# EasyEDA Pro project 2230506226.epro

# Schematic B1

## Sheets
1 ETH: Board Name: Project; Create Date: 2025-04-10; Page Name: ETH; Project Name: 14届真题; Schematic Name: B1; Update Date: 2025-04-10
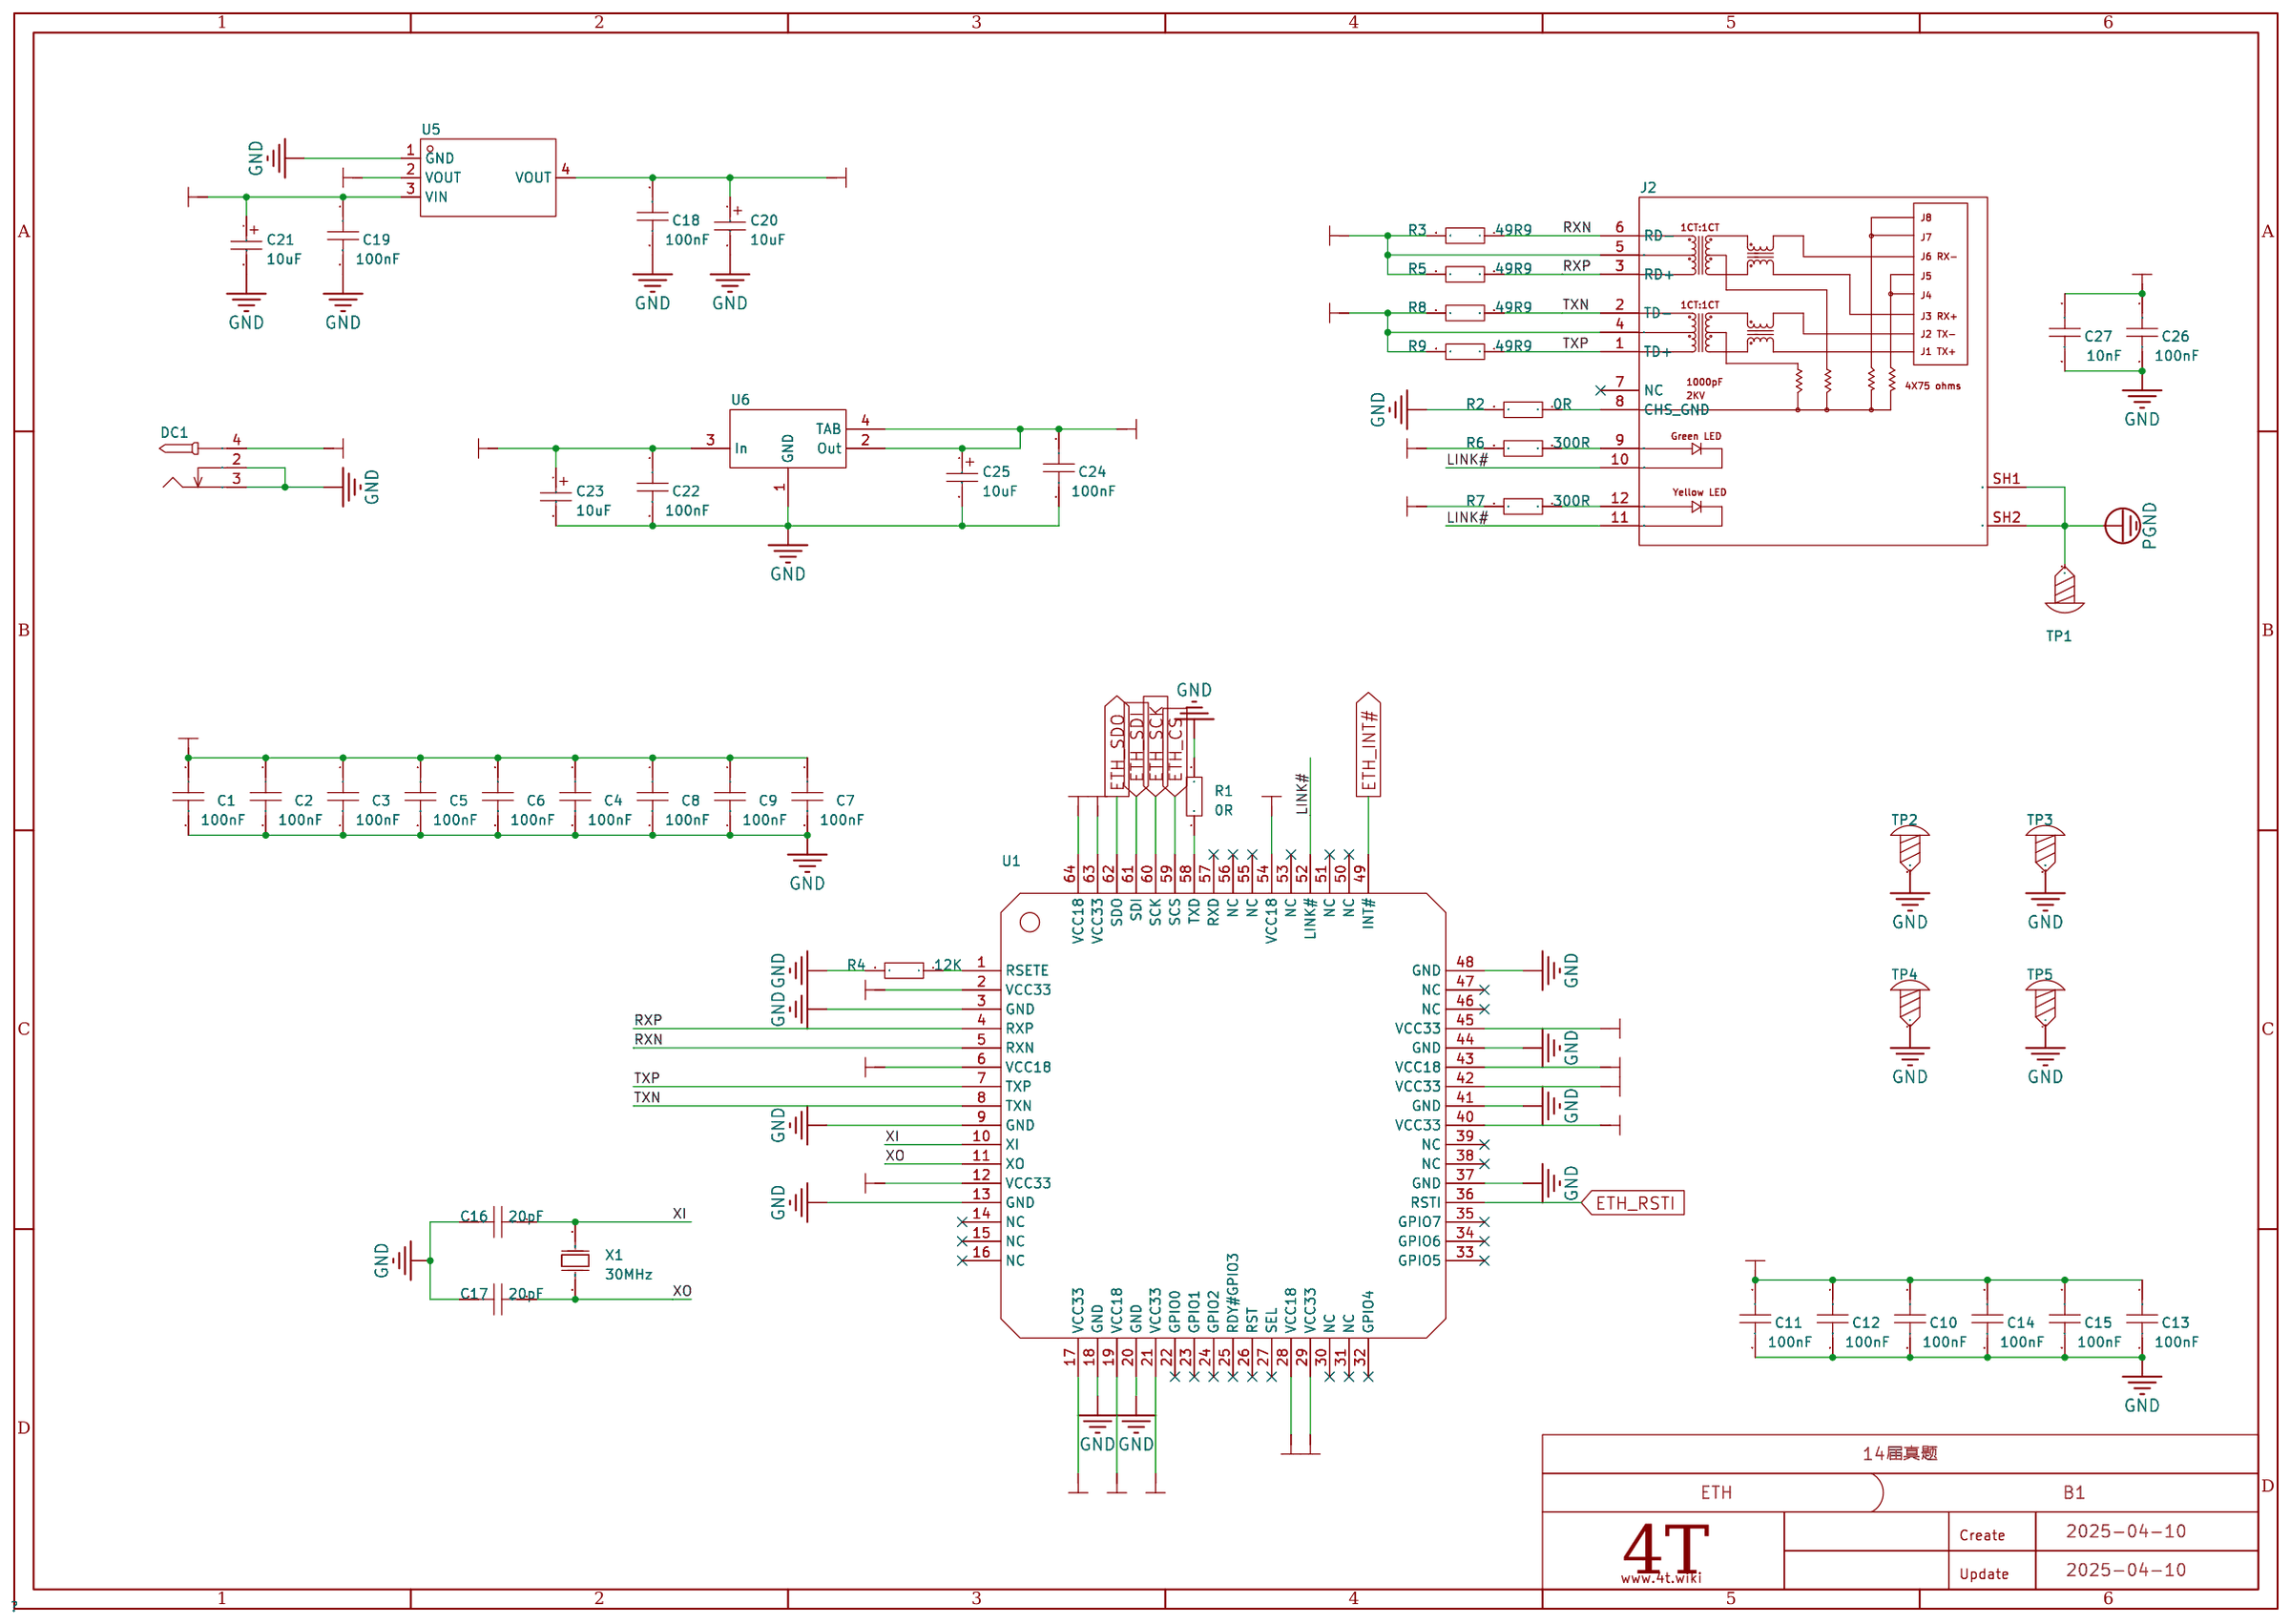
[diagram p0: ETH]
2 MP: Page Name: MP
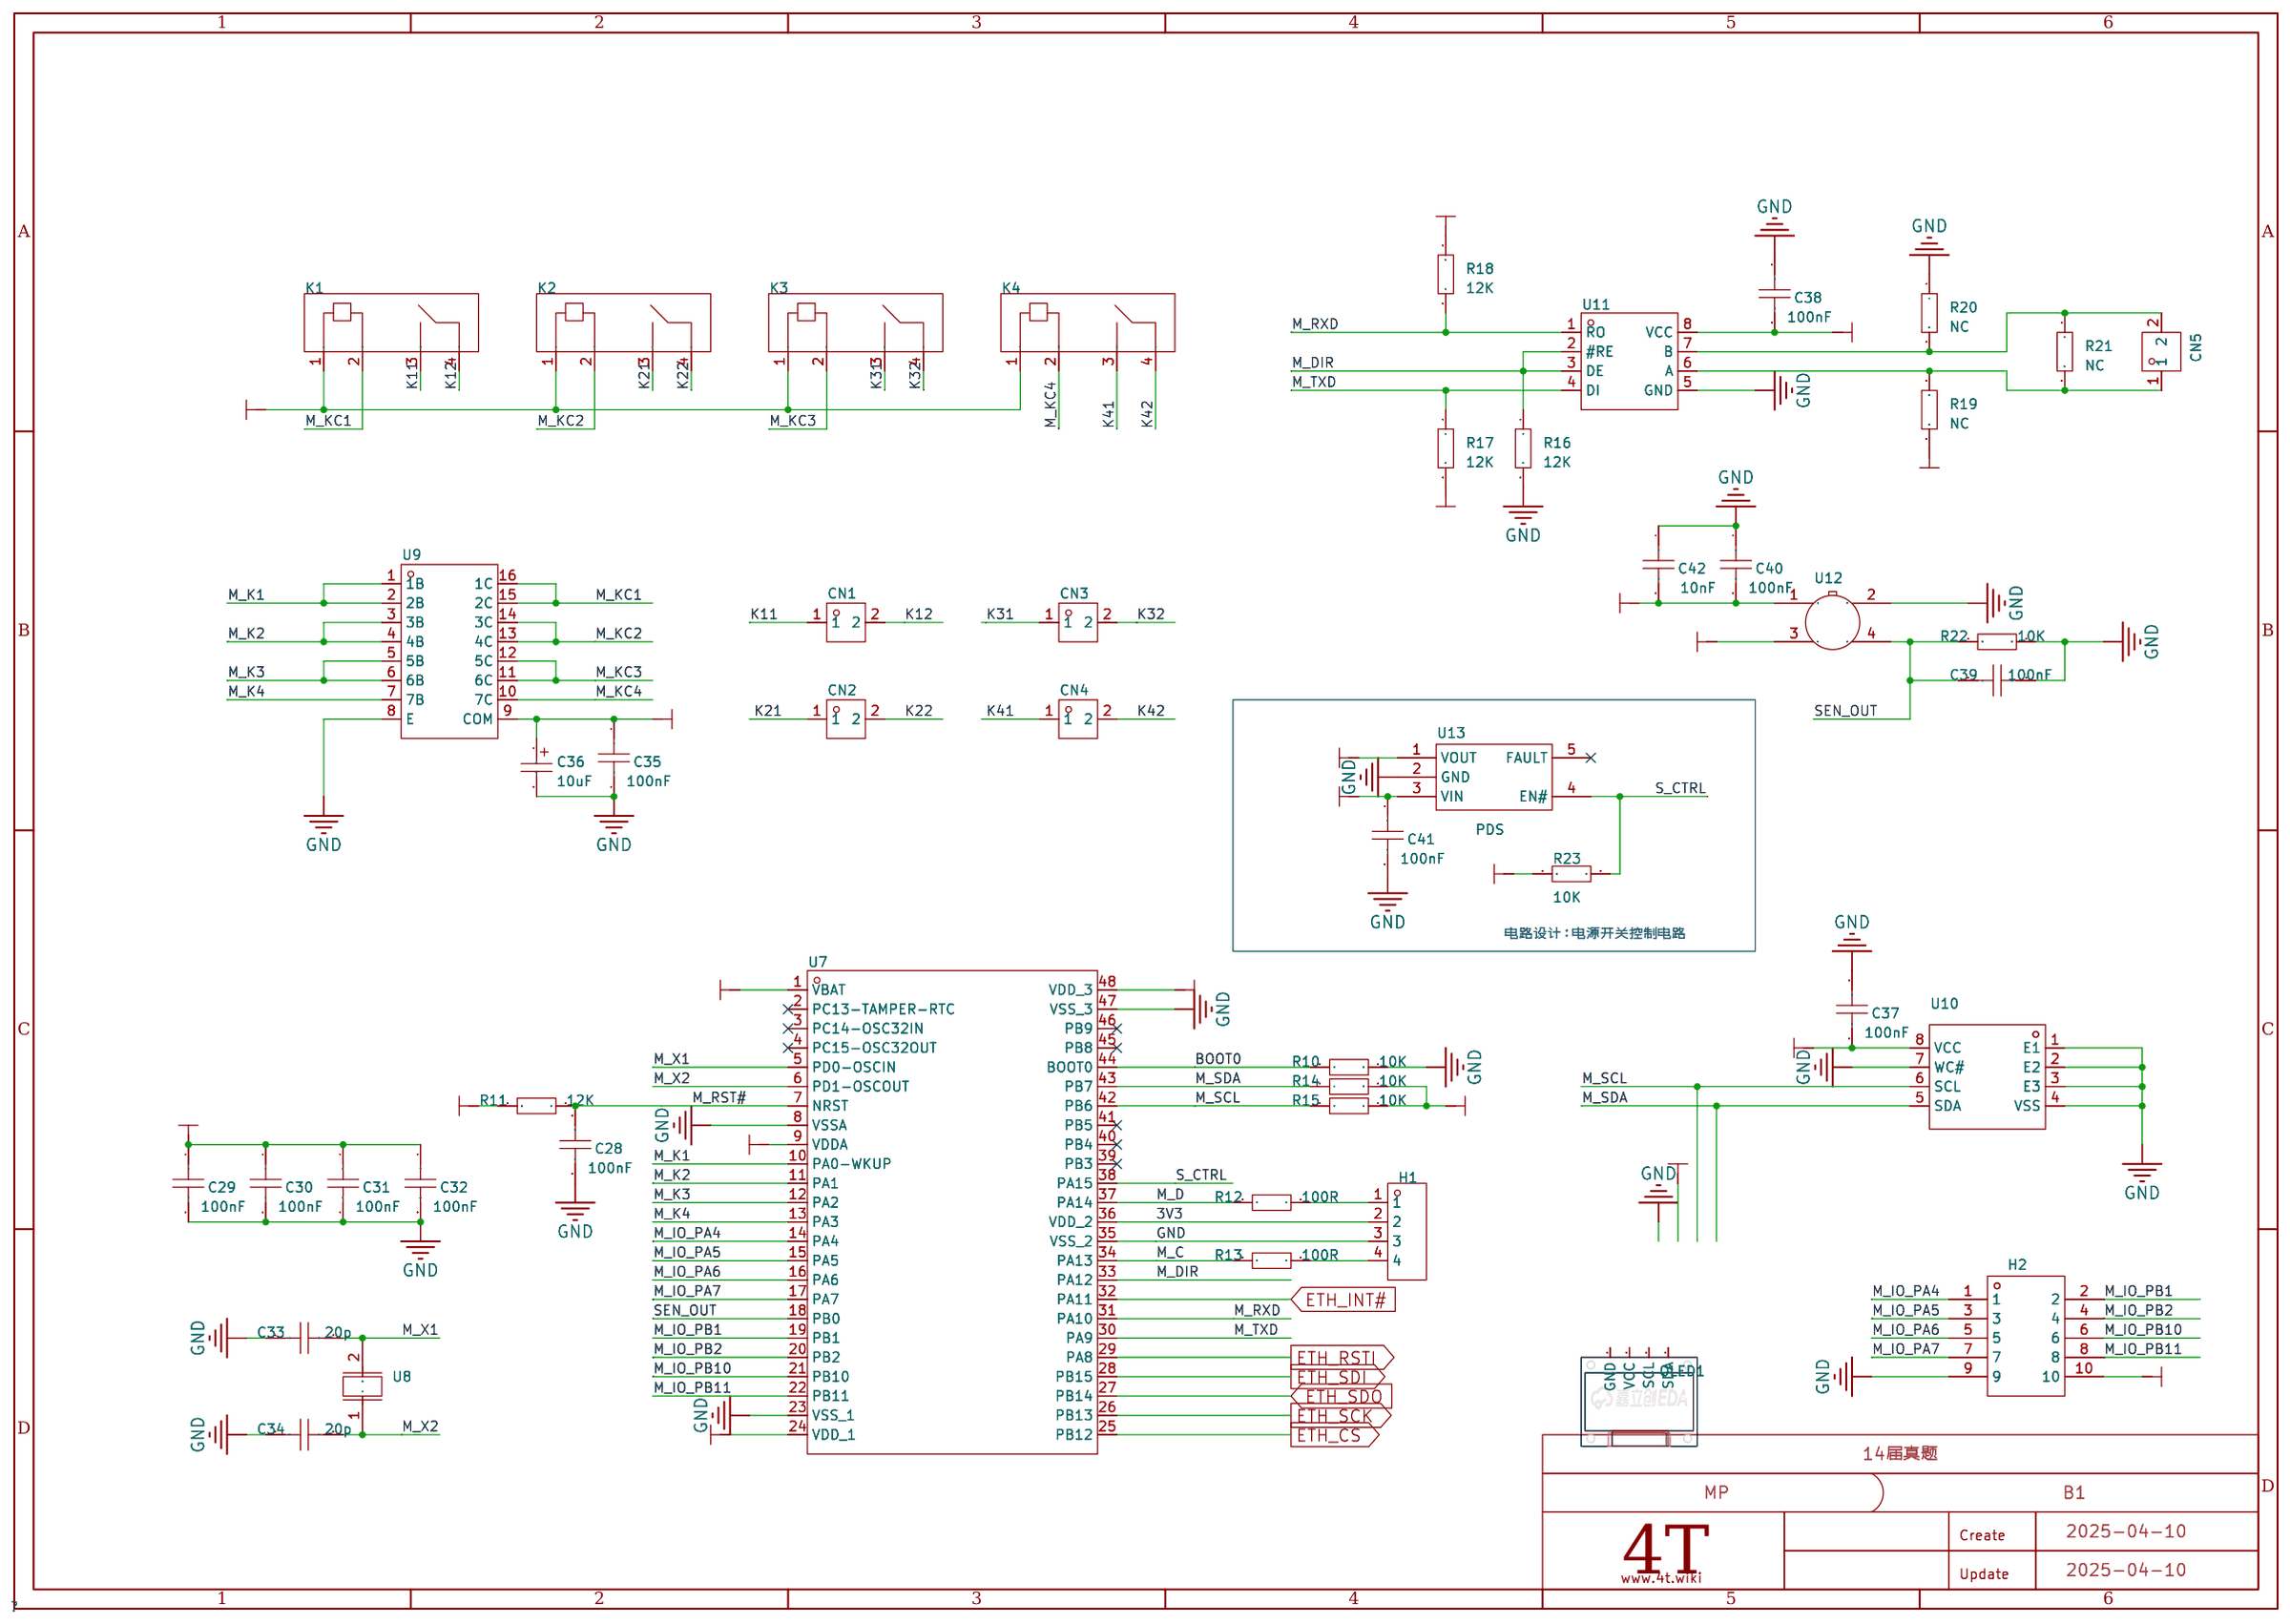
[diagram p1: MP]

## Parts
sheet ETH
C1  100nF  [C0805]
C2  100nF  [C0805]
C3  100nF  [C0805]
C4  100nF  [C0805]
C5  100nF  [C0805]
C6  100nF  [C0805]
C7  100nF  [C0805]
C8  100nF  [C0805]
C9  100nF  [C0805]
C10  100nF  [C0805]
C11  100nF  [C0805]
C12  100nF  [C0805]
C13  100nF  [C0805]
C14  100nF  [C0805]
C15  100nF  [C0805]
C16  20pF  [C0805]
C17  20pF  [C0805]
C18  100nF  [C0805]
C19  100nF  [C0805]
C20  10uF  [C_Ele_SMD_3x5.4mm]
C21  10uF  [C_Ele_SMD_3x5.4mm]
C22  100nF  [C0805]
C23  10uF  [C_Ele_SMD_3x5.4mm]
C24  100nF  [C0805]
C25  10uF  [C_Ele_SMD_3x5.4mm]
C26  100nF  [C0805]
C27  10nF  [C0805]
DC1  -  [DC-2.0]
J2  HY911105AE  [RJ45-TH_HR911105A]
R1  0R  [R0805]
R2  0R  [R0805]
R3  49R9  [R0805]
R4  12K  [R0805]
R5  49R9  [R0805]
R6  300R  [R0805]
R7  300R  [R0805]
R8  49R9  [R0805]
R9  49R9  [R0805]
TP1  -  [M3螺丝]
TP2  -  [M2螺丝]
TP3  -  [M2螺丝]
TP4  -  [M2螺丝]
TP5  -  [M2螺丝]
U1  CH395Q  [LQFP-64_L10.0-W10.0-P0.50-LS12.0-BL]
U5  AMS1117-3.3  [SOT-223-3_L6.5-W3.4-P2.30-LS7.0-BR]
U6  AMS1117-1.8  [SOT-223-4_L6.5-W3.5-P2.30-LS7.0-BR]
X1  30MHz  [OSC-SMD_L5.0-W3.2]
sheet MP
C28  100nF  [C0805]
C29  100nF  [C0805]
C30  100nF  [C0805]
C31  100nF  [C0805]
C32  100nF  [C0805]
C33  20p  [C0805]
C34  20p  [C0805]
C35  100nF  [C0805]
C36  10uF  [C_Ele_SMD_3x5.4mm]
C37  100nF  [C0805]
C38  100nF  [C0805]
C39  100nF  [C0805]
C40  100nF  [C0805]
C41  100nF  [C0805]
C42  10nF  [C0805]
CN1  KF128L-5.08-2P 蓝色  [TH_KF128L-5.08-2P]
CN2  KF128L-5.08-2P 蓝色  [TH_KF128L-5.08-2P]
CN3  KF128L-5.08-2P 蓝色  [TH_KF128L-5.08-2P]
CN4  KF128L-5.08-2P 蓝色  [TH_KF128L-5.08-2P]
CN5  KF128L-5.08-2P 蓝色  [TH_KF128L-5.08-2P]
H1  -  [HDR-TH_4P-P2.54-V-F]
H2  -  [HDR-TH_10P-P2.54-V-M-R2-C5-S2.54]
K1  HF49FD/012-1H12  [RELAY-TH_HF49FD-XXX-1H12-XXX]
K2  HF49FD/012-1H12  [RELAY-TH_HF49FD-XXX-1H12-XXX]
K3  HF49FD/012-1H12  [RELAY-TH_HF49FD-XXX-1H12-XXX]
K4  HF49FD/012-1H12  [RELAY-TH_HF49FD-XXX-1H12-XXX]
OLED1  -  [0.96OLED_4P]
R10  10K  [R0805]
R11  12K  [R0805]
R12  100R  [R0805]
R13  100R  [R0805]
R14  10K  [R0805]
R15  10K  [R0805]
R16  12K  [R0805]
R17  12K  [R0805]
R18  12K  [R0805]
R19  NC  [R0805]
R20  NC  [R0805]
R21  NC  [R0805]
R22  10K  [R0805]
R23  10K  [R0805]
U7  GD32F303CBT6  [LQFP-48_L7.0-W7.0-P0.50-LS9.0-BL]
U8  8M-5032-2P  [CRYSTAL-SMD_L5.0-W3.2]
U9  ULN2003  [SOIC-16_L9.9-W3.9-P1.27-LS6.0-BL]
U10  M24C02-WMN6TP  [SOIC-8_L4.9-W3.9-P1.27-LS6.0-BL]
U11  MAX3485ESA  [SOP-8_L5.0-W4.0-P1.27-LS6.0-BL]
U12  MP-2  [SENSOR-TH_MP-5]
U13  PDS  [SOT_PDS]

## Library data of the parts
C1-C19 C22 C24 C26-C35 C37-C42 = CAP_0603: Supplier Footprint: 0603
C20 C21 C23 C25 C36 = C_Ele_SMD_3x5.4mm: Supplier Footprint: SMD,3x5.4mm
DC1 = DC-005_2.0: Supplier Footprint: 插件
J2 = HY911105AE: 连接器类型:RJ插座;USOC代码:RJ45;端口数量:1;等级:-;屏蔽:-;LED:-;; LCSC Part Name: RJ45 带变压器; Supplier Part: C69427; Manufacturer: HANRUN(汉仁); Supplier Footprint: 插件; JLCPCB Part Class: 扩展库; Datasheet: https://atta.szlcsc.com/upload/public/pdf/source/20160507/1462613611469.pdf; Supplier: LCSC; Connector Type: RJ插座; USOC Codes: RJ45; Number of Ports: 1
R1-R23 = Res_0805: Supplier Footprint: 0805
TP1 = M3螺丝: Supplier Footprint: 插件
TP2-TP5 = M2螺丝: Supplier Footprint: 插件
U1 = CH395Q: 应用功能:以太网控制器;通道数:-;接口类型:Parallel, SPI, UART;电源电压:1.65V~3.6V;电源电流:90mA;; Supplier Part: C87390; Manufacturer: WCH(南京沁恒); Supplier Footprint: LQFP-64(10x10); JLCPCB Part Class: 扩展库; Datasheet: https://atta.szlcsc.com/upload/public/pdf/source/20200903/C87390_2BA27438C515B4B897A780BE99160E01.pdf; Supplier: LCSC; Application Function: 以太网控制器; Interface: Parallel, SPI, UART; Supply Voltage: 1.65V~3.6V; Supply Current: 90mA
U5 = AMS1117-3.3_C6186: 输出类型:固定;输出极性:正;输出通道数:1;最大输入电压:-;输出电压:3.3V;压差:1.3V@(800mA);静态电流(地电流):-;输出电流:1A;电源纹波抑制比(PSRR):72dB@(120Hz);噪声:-;特性:-;工作温度:-;; LCSC Part Name: 正 Vout=3.3V 1A 72dB@(120Hz); Supplier Part: C6186; Manufacturer: AMS; Supplier Footprint: SOT-223-3; JLCPCB Part Class: 基础库; Datasheet: https://atta.szlcsc.com/upload/public/pdf/source/20180727/C6186_7A095716F0823C02F1997A905E26C086.pdf; Supplier: LCSC; Output Type: 固定; Output Polarity: 正; Number of Outputs: 1; Output Voltage: 3.3V; Dropout Voltage: 1.3V@(800mA); Output Current: 1A; Power Supply Rejection Ratio (PSRR): 72dB@(120Hz)
U6 = AMS1117-1.8_C6185: 输出类型:固定;输出极性:正;输出通道数:1;最大输入电压:15V;输出电压:1.8V~1.8V;压差:1.3V@(1A);输出电流:1A;电源纹波抑制比(PSRR):75dB@(120Hz);; LCSC Part Name: 正 Vin=15V Vout=1.8V~1.8V 1A 75dB@(120Hz); Supplier Part: C6185; Manufacturer: AMS; Supplier Footprint: SOT-223-4; JLCPCB Part Class: 扩展库; Datasheet: https://atta.szlcsc.com/upload/public/pdf/source/20180727/C6186_7A095716F0823C02F1997A905E26C086.pdf; Supplier: LCSC; Output Type: 固定; Output Polarity: 正; Number of Outputs: 1; Maximum Input Voltage: 15V; Output Voltage: 1.8V~1.8V; Dropout Voltage: 1.3V@(1A); Output Current: 1A; Power Supply Rejection Ratio (PSRR): 75dB@(120Hz)
X1 = X503230MSB2GI: 晶振类型:贴片无源晶振;频率:30MHz;频率公差:±10ppm;频率稳定度:±50ppm;负载电容:20pF;工作温度:-40℃~+85℃;; LCSC Part Name: YSX530GA 30MHz ±10ppm 20pF; Supplier Part: C112563; Manufacturer: YXC(扬兴晶振); Supplier Footprint: SMD5032-2P; JLCPCB Part Class: 扩展库; Datasheet: https://atta.szlcsc.com/upload/public/pdf/source/20210329/C112559_847D3CACBA33ACCEB57DEA3AEBB187A1.pdf; Supplier: LCSC; Crystal Type: 贴片无源晶振; Frequency Tolerance: ±10ppm; Frequency Stability: ±50ppm; Load Capacitance: 20pF; Operating Temperature: -40℃~+85℃
CN1-CN5 = KF128L-5.08-2P 蓝色: Supplier Part: C2916931; Supplier Footprint: 5.08-2P; JLCPCB Part Class: 扩展库; Supplier: LCSC
H1 = HDR-F_2.54_1x4P: Supplier Part: C2718488; Supplier Footprint: 插件
H2 = HDR-M_2.54_2x5: Supplier Part: C124387; Supplier Footprint: 插件,P=2.54mm
K1-K4 = HF49FD/012-1H12: 线圈电压:12V;线圈类型:非极化-单线圈;触点形式:一组常开:1A(单刀单掷-常开);最大切换电流:5A;触点材料:AgNi;; LCSC Part Name: 宏发继电器; Supplier Part: C399491; Manufacturer: HF(宏发); Supplier Footprint: SIP-4; JLCPCB Part Class: 扩展库; Datasheet: https://atta.szlcsc.com/upload/public/pdf/source/20190620/C399491_B2190B02DDD565265172868420E7880D.pdf; Supplier: LCSC; Coil Voltage: 12V; Coil Type: 非极化-单线圈; Pin Number: 4; Contact Form: 一组常开:1A(单刀单掷-常开); Maximum Switching Current: 5A; Maximum Switching Voltage: 250V@AC；30V@DC; Coil Rated Power: 120mW; Contact Rating: 5A@30VDC；5A@250VAC; Coil Resistance: 1.2kΩ; Operate Time: 10ms; Release Time: 5ms; Contact Resistance: 100mΩ; Contact Material: AgNi; Operating Temperature: -40℃~+85℃
OLED1 = 0.96OLED模块_4P: Supplier Footprint: 插件
U7 = GD32F303CBT6_C3013779: CPU内核:ARM Cortex-M4;CPU最大主频:120MHz;工作电压范围:-;程序存储容量:128KB;RAM总容量:32KB;EEPROM/数据 FLASH容量:128KB;GPIO端口数量:37;ADC(位数):12bit;DAC(位数):12bit;(E)PWM(位数):-;8位Timer数量:-;16位Timer数量:7;32位Timer数量:-;CAN路数:1;U(S)ART路数:3;I2C路数:2;I2S路数:2;(Q)SPI路数:3;外设/功能:看门狗；RTC实时时钟;内部振荡器:; LCSC Part Name: ARM Cortex-M4 120MHz; Supplier Part: C3013779; Manufacturer: GigaDevice(兆易创新); Supplier Footprint: LQFP-48(7x7); JLCPCB Part Class: 扩展库; Datasheet: https://atta.szlcsc.com/upload/public/pdf/source/20220624/E1A57ED816B162D6D1424864911A792F.pdf; Supplier: LCSC; CPU Core: ARM Cortex-M4; CPU Maximum Speed: 120MHz; Program Storage Size: 128KB; Program Memory Type: FLASH; RAM Size: 32KB; EEPROM: 128KB; GPIO Ports Number: 37; ADC (Bit): 12bit; DAC (Bit): 12bit; 16Bit Timer: 7; CAN: 1; UART/USART: 3; I2C: 2; I2S: 2; SPI: 3; Peripheral/Function: 看门狗；RTC实时时钟; Watchdog: 有; Real-Time Clock: 有
U8 = 8M-5032-2P: Supplier Part: C9900017580; Supplier Footprint: 8MHz; JLCPCB Part Class: 扩展库; Supplier: LCSC
U9 = ULN2003: 开态输入电压(VI(on)@Vce,Ic):3V@2V,300mA;集射极饱和压降(VCE(sat)@Ii,Ic):1.2V@500uA,350mA;输出漏电流(Icex@Vce):50uA@50V;开态输入电流(Ii@Vi):-;关态输入电流(Ii(off)@Vce,Ic):65uA@50V,500uA;嵌位二极管漏电流(IR@VR):50uA@50V;嵌位二极管正向压降(VF@IF):1.7V@350mA;输入电容(Ci):15pF;工作温度:-20℃~+85℃;; Supplier Part: C688859; Manufacturer: IDCHIP(英锐芯); Supplier Footprint: SOIC-16; JLCPCB Part Class: 扩展库; Datasheet: https://atta.szlcsc.com/upload/public/pdf/source/20210302/C688859_5C67C6CBB0EA78EF92AFC966B53E1AD0.pdf; Supplier: LCSC; ON-state input   voltage(VI(on)@Vce,Ic): 3V@2V,300mA; Collector-emitter   saturation voltage (VCE(sat)@Ii,Ic): 1.2V@500uA,350mA; Output leakage current (Icex@Vce): 50uA@50V; Off-state input current (Ii(off)@Vce,Ic): 65uA@50V,500uA; Clamp Diode Leakage Current (IR@VR): 50uA@50V; Clamp Diode Forward Voltage (VF@IF): 1.7V@350mA; Input Capacitance (Ci): 15pF; Operating Temperature: -20℃~+85℃
U10 = M24C02-WMN6TP: 2-Kbit(256 x 8bit)，I2C接口，工作电压：2.5V to 5.5V; Supplier Part: C7562; Manufacturer: ST(意法半导体); Supplier Footprint: SOIC-8; JLCPCB Part Class: 基础库; Datasheet: https://atta.szlcsc.com/upload/public/pdf/source/20140724/1457707167301.pdf; Supplier: LCSC
U11 = MAX3485ESA: Supplier Part: C668204; Manufacturer: UMW(广东友台半导体); Supplier Footprint: SOP-8; JLCPCB Part Class: 扩展库; Datasheet: https://atta.szlcsc.com/upload/public/pdf/source/20221009/BC018EFD0F414E24649E284F574E449C.pdf; Supplier: LCSC
U12 = MP-2: Supplier Part: C242497; Manufacturer: Winsen(炜盛); Supplier Footprint: 插件; JLCPCB Part Class: 扩展库; Datasheet: https://atta.szlcsc.com/upload/public/pdf/source/20180704/C242497_B8D2418C2743DA3210851F2FB82DA8BD.pdf; Supplier: LCSC
U13 = PDS

## Nets
1V8: C10.1 C11.1 C12.1 C13.1 C14.1 C15.1 C24.1 C25.1 U1.6(VCC18) U1.19(VCC18) U1.28(VCC18) U1.43(VCC18) U1.54(VCC18) U1.63(VCC33) U6.2(Out) U6.4(TAB)
3V3: C1.1 C2.1 C3.1 C4.1 C5.1 C6.1 C7.1 C8.1 C9.1 C18.1 C20.1 C22.1 C23.1 C26.1 C27.1 C29.1 C30.1 C31.1 C32.1 C37.2 C38.2 H1.2 H2.10 J2.4 J2.5 R3.2 R5.2 R6.2 R7.2 R8.2 R9.2 R11.2 R14.2 R15.1 R17.2 R18.1 R19.2 R23.1 U1.2(VCC33) U1.12(VCC33) U1.17(VCC33) U1.21(VCC33) U1.29(VCC33) U1.40(VCC33) U1.42(VCC33) U1.45(VCC33) U1.64(VCC18) U5.2(VOUT) U5.4(VOUT) U6.3(In) U7.1(VBAT) U7.9(VDDA) U7.24(VDD_1) U7.36(VDD_2) U7.48(VDD_3) U10.8(VCC) U11.8(VCC) U12.3
GND: C1.2 C2.2 C3.2 C4.2 C5.2 C6.2 C7.2 C8.2 C9.2 C10.2 C11.2 C12.2 C13.2 C14.2 C15.2 C16.1 C17.1 C18.2 C19.2 C20.2 C21.2 C22.2 C23.2 C24.2 C25.2 C26.2 C27.2 C28.2 C29.2 C30.2 C31.2 C32.2 C33.1 C34.1 C35.2 C36.2 C37.1 C38.1 C39.2 C40.1 C41.2 C42.1 DC1.2 DC1.3 H1.3 H2.9 R1.2 R2.2 R4.2 R10.1 R16.2 R20.1 R22.2 TP2.1 TP3.1 TP4.1 TP5.1 U1.3(GND) U1.9(GND) U1.13(GND) U1.18(GND) U1.20(GND) U1.37(GND) U1.41(GND) U1.44(GND) U1.48(GND) U5.1(GND) U6.1(GND) U7.8(VSSA) U7.23(VSS_1) U7.35(VSS_2) U7.47(VSS_3) U9.8(E) U10.1(E1) U10.2(E2) U10.3(E3) U10.4(VSS) U10.7(WC#) U11.5(GND) U12.2 U13.2(GND)
PGND: J2.SH1 J2.SH2 TP1.1
BOOT0: R10.2 U7.44(BOOT0)
DC: C19.1 C21.1 C35.1 C36.1 C41.1 DC1.4 K1.1 K2.1 K3.1 K4.1 U5.3(VIN) U9.9(COM) U13.3(VIN)
ETH_CS: U1.59(SCS) U7.25(PB12)
ETH_INT#: U1.49(INT#) U7.32(PA11)
ETH_RSTI: U1.36(RSTI) U7.29(PA8)
ETH_SCK: U1.60(SCK) U7.26(PB13)
ETH_SDI: U1.61(SDI) U7.28(PB15)
ETH_SDO: U1.62(SDO) U7.27(PB14)
K11: CN1.1 K1.3
K12: CN1.2 K1.4
K21: CN2.1 K2.3
K22: CN2.2 K2.4
K31: CN3.1 K3.3
K32: CN3.2 K3.4
K41: CN4.1 K4.3
K42: CN4.2 K4.4
LINK#: J2.10 J2.11 U1.52(LINK#)
M_C: R13.2 U7.34(PA13)
M_D: R12.2 U7.37(PA14)
M_DIR: R16.1 U7.33(PA12) U11.2(#RE) U11.3(DE)
M_IO_PA4: H2.1 U7.14(PA4)
M_IO_PA5: H2.3 U7.15(PA5)
M_IO_PA6: H2.5 U7.16(PA6)
M_IO_PA7: H2.7 U7.17(PA7)
M_IO_PB1: H2.2 U7.19(PB1)
M_IO_PB2: H2.4 U7.20(PB2)
M_IO_PB10: H2.6 U7.21(PB10)
M_IO_PB11: H2.8 U7.22(PB11)
M_K1: U7.10(PA0-WKUP) U9.1(1B) U9.2(2B)
M_K2: U7.11(PA1) U9.3(3B) U9.4(4B)
M_K3: U7.12(PA2) U9.5(5B) U9.6(6B)
M_K4: U7.13(PA3) U9.7(7B)
M_KC1: K1.2 U9.15(2C) U9.16(1C)
M_KC2: K2.2 U9.13(4C) U9.14(3C)
M_KC3: K3.2 U9.11(6C) U9.12(5C)
M_KC4: K4.2 U9.10(7C)
M_RST#: C28.1 R11.1 U7.7(NRST)
M_RXD: R18.2 U7.31(PA10) U11.1(RO)
M_SCL: R15.2 U7.42(PB6) U10.6(SCL)
M_SDA: R14.1 U7.43(PB7) U10.5(SDA)
M_TXD: R17.1 U7.30(PA9) U11.4(DI)
M_X1: C33.2 U7.5(PD0-OSCIN) U8.2
M_X2: C34.2 U7.6(PD1-OSCOUT) U8.1
RXN: J2.6(RD-) R3.1 U1.5(RXN)
RXP: J2.3(RD+) R5.1 U1.4(RXP)
S_CTRL: R23.2 U7.38(PA15) U13.4(EN#)
SEN_OUT: C39.1 R22.1 U7.18(PB0) U12.4
TXN: J2.2(TD-) R8.1 U1.8(TXN)
TXP: J2.1(TD+) R9.1 U1.7(TXP)
V_HU: C40.2 C42.2 U12.1 U13.1(VOUT)
XI: C16.2 U1.10(XI) X1.2(OSC2)
XO: C17.2 U1.11(XO) X1.1(OSC1)
$1N6890: R4.1 U1.1(RSETE)
$1N7627: R1.1 U1.58(TXD)
$1N10654: J2.8(CHS GND) R2.1
$1N10919: J2.12 R7.1
$1N10952: J2.9 R6.1
$2N5291: H1.1 R12.1
$2N5344: H1.4 R13.1
$2N14954: CN5.2 R20.2 R21.1 U11.7(B)
$2N14989: CN5.1 R19.1 R21.2 U11.6(A)

Not connected (* = marked no-connect by the designer): J2 7(NC)*; OLED1 1(GND) 2(VCC) 3(SCL) 4(SDA); U1 14(NC)* 15(NC)* 16(NC)* 22(GPIO0)* 23(GPIO1)* 24(GPIO2)* 25(RDY#GPIO3)* 26(RST)* 27(SEL)* 30(NC)* 31(NC)* 32(GPIO4)* 33(GPIO5)* 34(GPIO6)* 35(GPIO7)* 38(NC)* 39(NC)* 46(NC)* 47(NC)* 50(NC)* 51(NC)* 53(NC)* 55(NC)* 56(NC)* 57(RXD)*; U7 2(PC13-TAMPER-RTC)* 3(PC14-OSC32IN)* 4(PC15-OSC32OUT)* 39(PB3)* 40(PB4)* 41(PB5)* 45(PB8)* 46(PB9)*; U13 5(FAULT)*

## Notes on the sheets
sheet 2
- 电路设计：电源开关控制电路

# Board B1
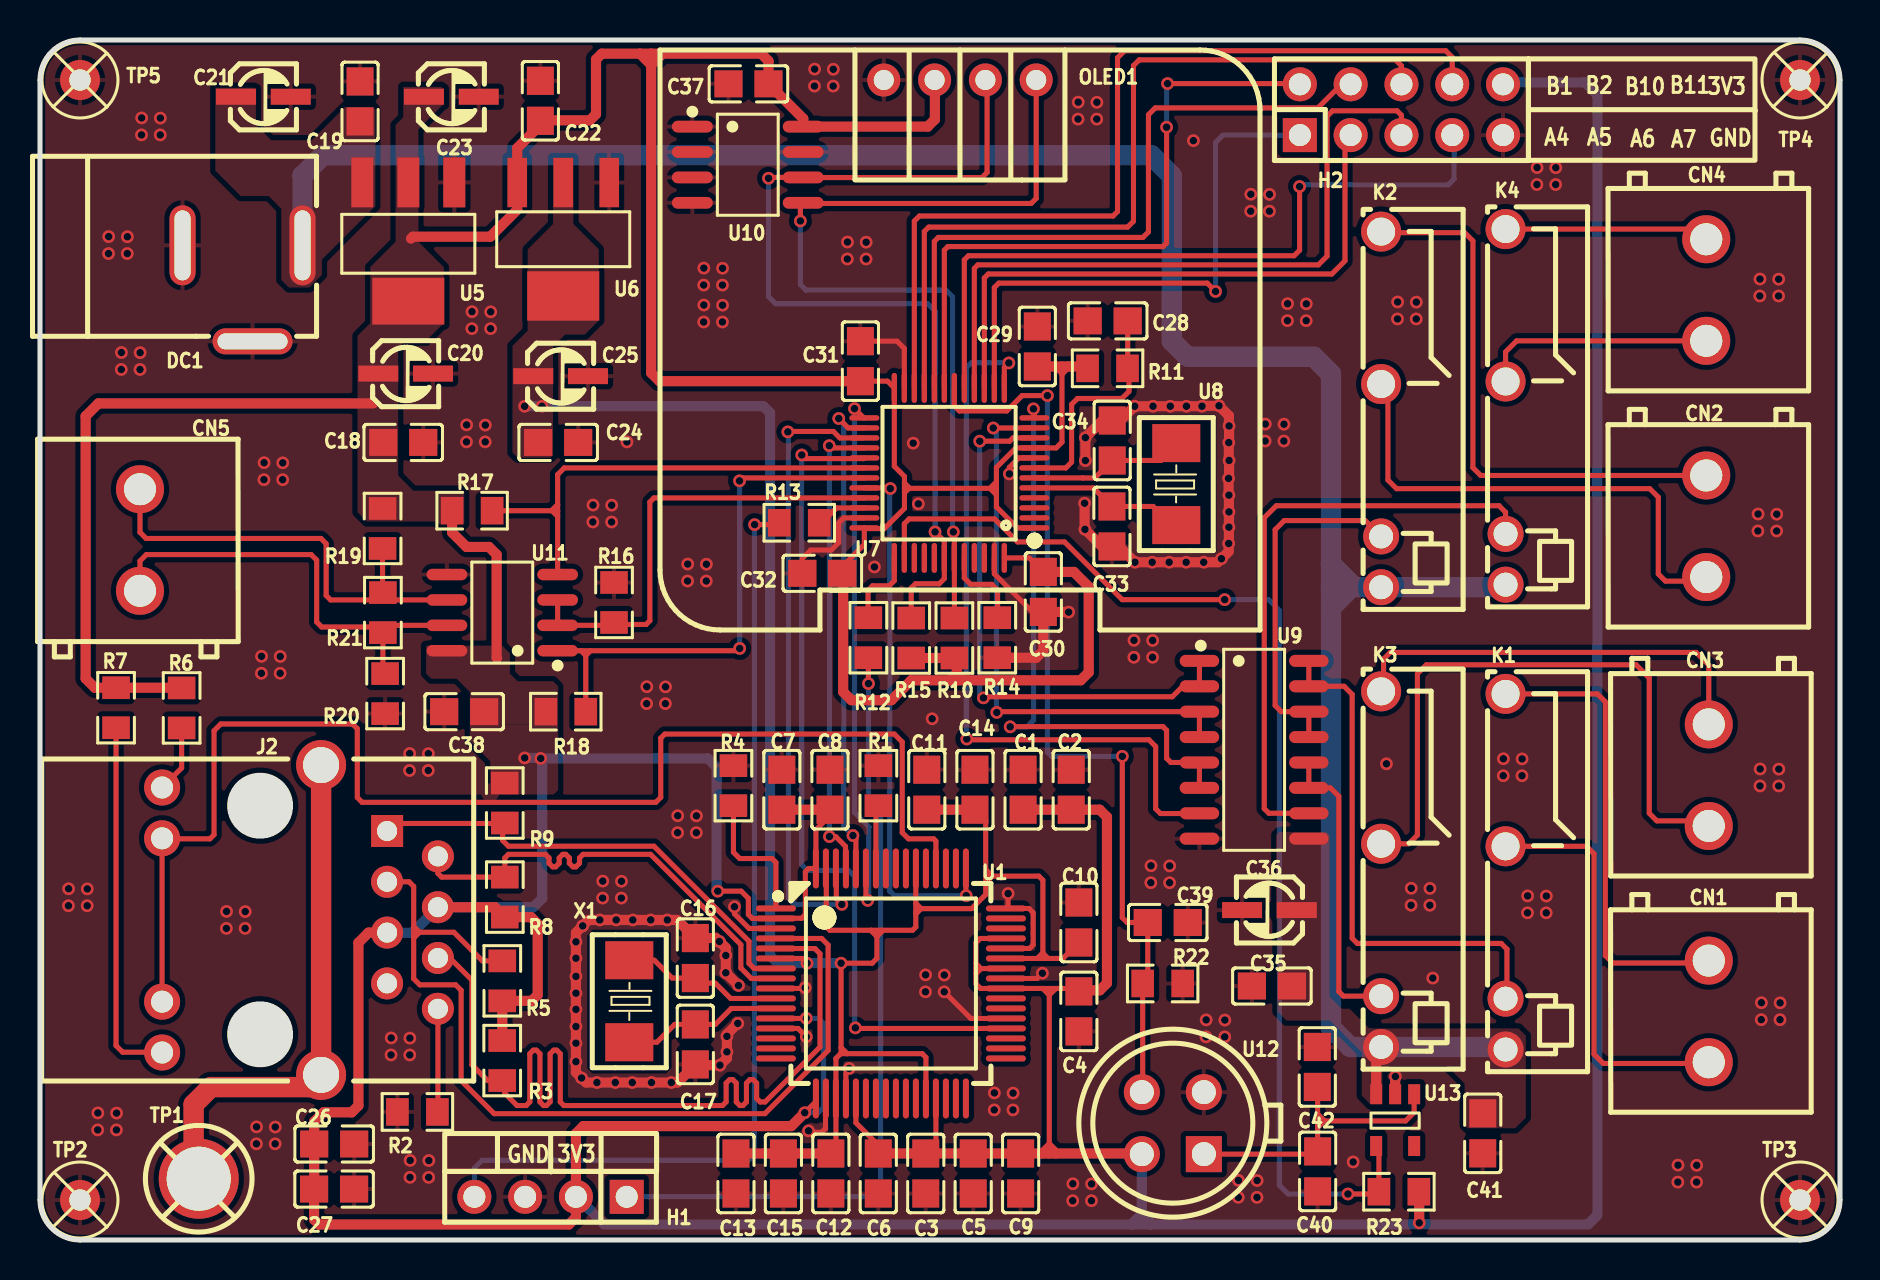
[diagram p2: board, top side]
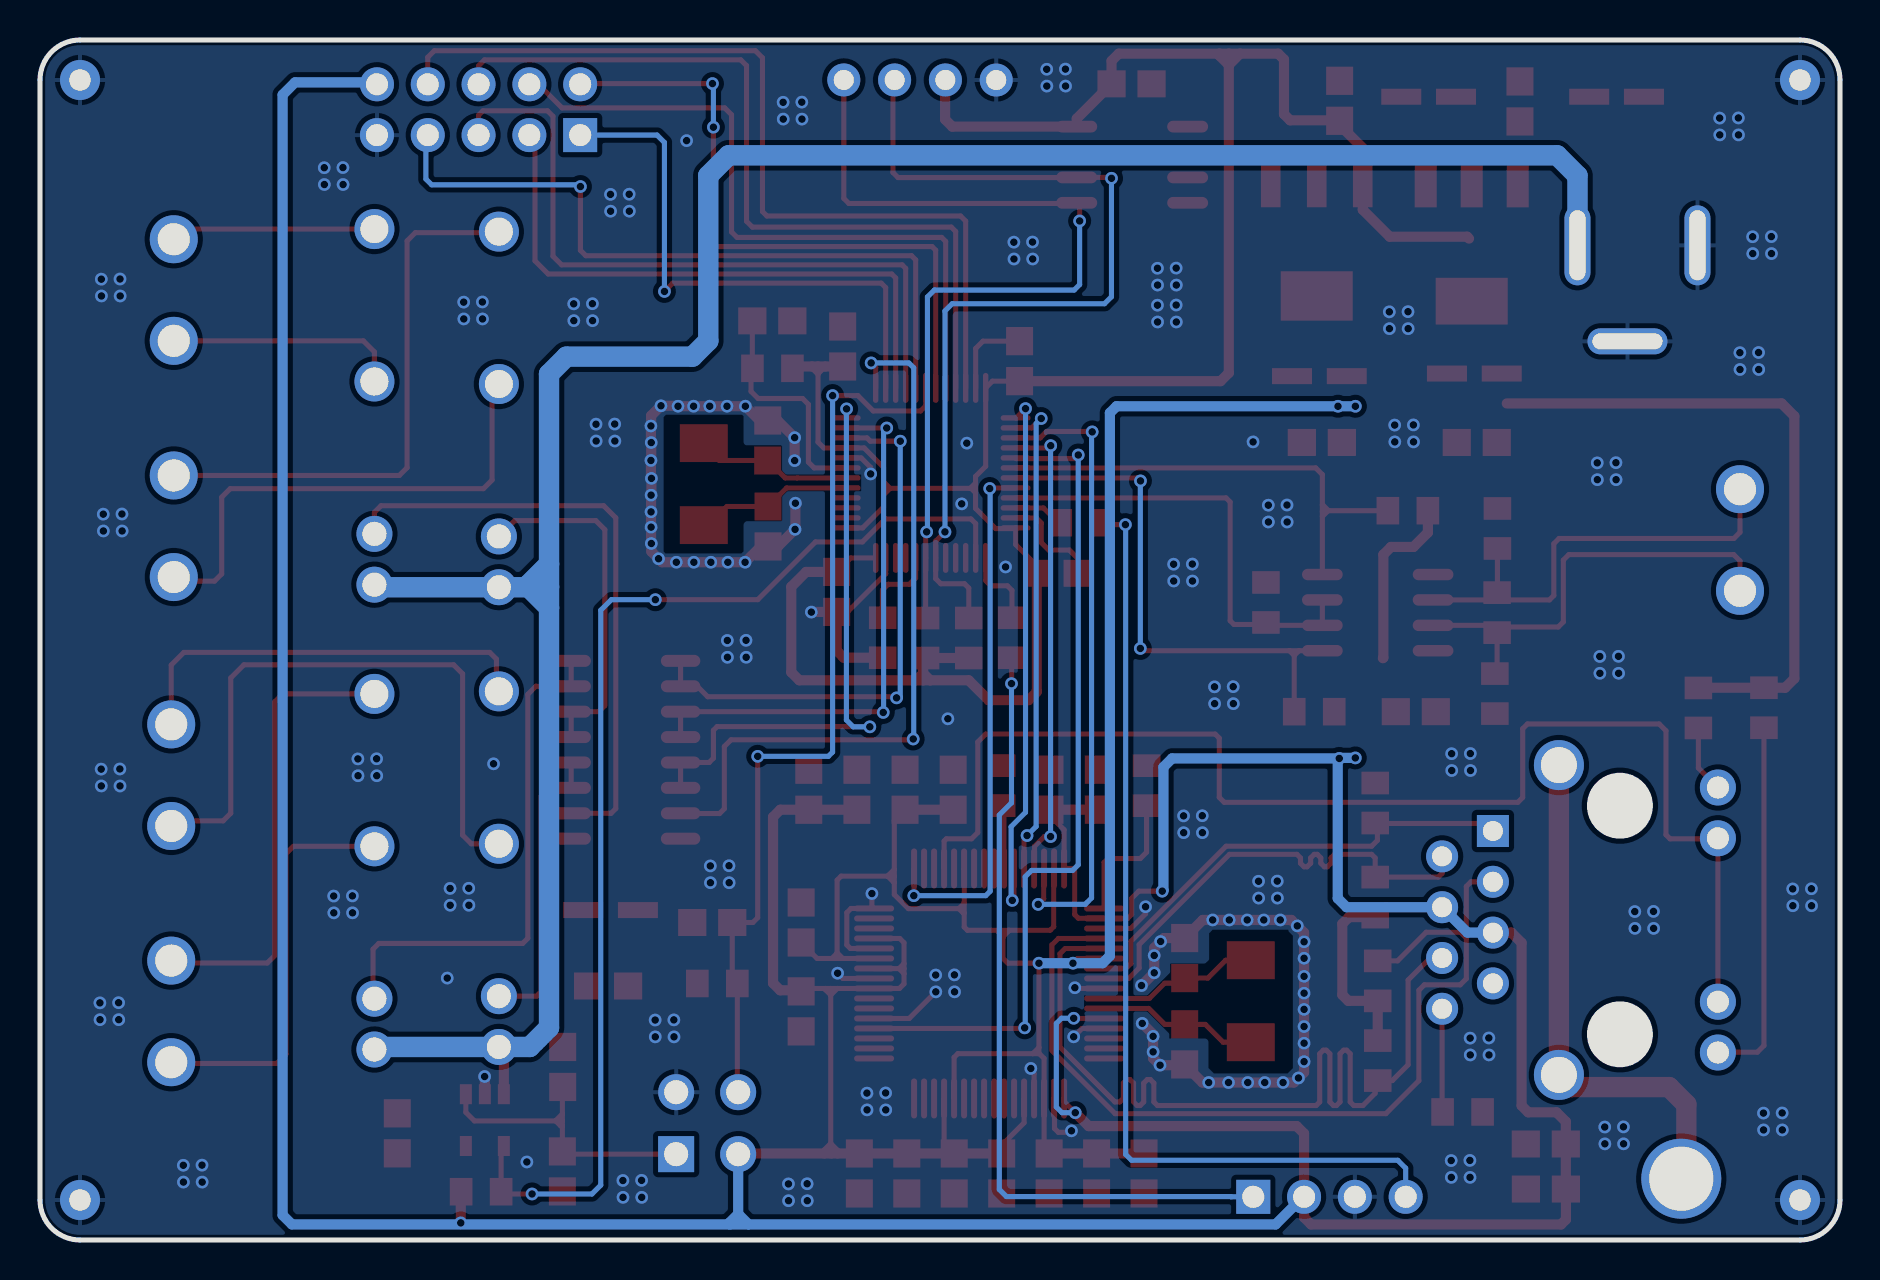
[diagram p3: board, bottom side, seen from below]

Outline 90 x 60 mm; copper layers: Top Layer, Bottom Layer. Coordinates in mm from the lower left corner of the outline.
Outline path: 0,58 0,2 arc(0.59,0.59) 2,0 88,0 arc(89.41,0.59) 90,2 90,58 arc(89.41,59.41) 88,60 2,60 arc(0.59,59.41) 0,58
Stack: Top Layer 0.035mm / Dielectric1 1.51mm FR4 er 4.5 / Bottom Layer 0.035mm

## Design rules (mm)
net $2N14989: AB
net $2N14954: AB
net TXP: TX_NP
net TXN: TX_NP
net RXP: RX_NP
net RXN: RX_NP
template: 用户自定义配置
spacing safeClearance (default): track to track 0.203, other pairs 0.152 to 0.203
track width trackWidth (default): min 0.254, default 0.254, max 2.54
track width pwr: min 0.254, default 0.508, max 2.54
differential pair differentialPair (default): width min 0.127, default 0.254, max 2.54; gap min 0.152, default 0.152
via viaSize (default): diameter min 0.635, default 0.635, max 10; hole min 0.381, default 0.381, max 5.999
net 3V3 uses pwr
net GND uses pwr
net PGND uses pwr
net 1V8 uses pwr
net DC uses pwr

## Placement (name value [footprint] x y rotation side)
C1  100nF  [C0805]  49.16 22.51 90 top
C2  100nF  [C0805]  51.56 22.51 90 top
C3  100nF  [C0805]  44.29 3.33 270 top
C4  100nF  [C0805]  51.94 11.43 270 top
C5  100nF  [C0805]  46.66 3.33 270 top
C6  100nF  [C0805]  41.91 3.33 270 top
C7  100nF  [C0805]  37.09 22.51 90 top
C8  100nF  [C0805]  39.5 22.51 90 top
C9  100nF  [C0805]  49.03 3.33 270 top
C10  100nF  [C0805]  51.94 15.88 90 top
C11  100nF  [C0805]  44.34 22.51 90 top
C12  100nF  [C0805]  39.54 3.33 270 top
C13  100nF  [C0805]  34.8 3.33 270 top
C14  100nF  [C0805]  46.75 22.51 90 top
C15  100nF  [C0805]  37.17 3.33 270 top
C16  20pF  [C0805]  32.77 14.1 270 top
C17  20pF  [C0805]  32.77 9.78 90 top
C18  100nF  [C0805]  18.16 39.88 0 top
C19  100nF  [C0805]  16 56.93 90 top
C20  10uF  [C_Ele_SMD_3x5.4mm]  18.29 43.31 180 top
C21  10uF  [C_Ele_SMD_3x5.4mm]  11.18 57.15 180 top
C22  100nF  [C0805]  25.02 56.96 90 top
C23  10uF  [C_Ele_SMD_3x5.4mm]  20.57 57.15 180 top
C24  100nF  [C0805]  25.91 39.88 0 top
C25  10uF  [C_Ele_SMD_3x5.4mm]  26.03 43.18 180 top
C26  100nF  [C0805]  14.71 4.8 0 top
C27  10nF  [C0805]  14.7 2.55 0 top
C28  100nF  [C0805]  53.38 45.96 180 top
C29  100nF  [C0805]  49.87 44.68 90 top
C30  100nF  [C0805]  50.17 32.4 270 top
C31  100nF  [C0805]  41.02 43.94 90 top
C32  100nF  [C0805]  39.12 33.33 180 top
C33  20p  [C0805]  53.6 35.68 90 top
C34  20p  [C0805]  53.61 39.98 270 top
C35  100nF  [C0805]  61.59 12.7 180 top
C36  10uF  [C_Ele_SMD_3x5.4mm]  61.47 16.51 0 top
C37  100nF  [C0805]  35.42 57.81 0 top
C38  100nF  [C0805]  21.21 26.42 0 top
C39  100nF  [C0805]  56.39 15.88 0 top
C40  100nF  [C0805]  63.88 3.43 90 top
C41  100nF  [C0805]  72.14 5.33 270 top
C42  10nF  [C0805]  63.87 8.65 270 top
CN1  KF128L-5.08-2P 蓝色  [TH_KF128L-5.08-2P]  83.44 11.43 90 top
CN2  KF128L-5.08-2P 蓝色  [TH_KF128L-5.08-2P]  83.31 35.69 90 top
CN3  KF128L-5.08-2P 蓝色  [TH_KF128L-5.08-2P]  83.44 23.24 90 top
CN4  KF128L-5.08-2P 蓝色  [TH_KF128L-5.08-2P]  83.31 47.5 90 top
CN5  KF128L-5.08-2P 蓝色  [TH_KF128L-5.08-2P]  5 35 270 top
DC1  -  [DC-2.0]  10 50 180 top
H1  -  [HDR-TH_4P-P2.54-V-F]  25.53 2.16 180 top
H2  -  [HDR-TH_10P-P2.54-V-M-R2-C5-S2.54]  68.07 56.52 0 top
J2  HY911105AE  [RJ45-TH_HR911105A]  13 16 270 top
K1  HF49FD/012-1H12  [RELAY-TH_HF49FD-XXX-1H12-XXX]  73.28 18.42 90 top
K2  HF49FD/012-1H12  [RELAY-TH_HF49FD-XXX-1H12-XXX]  67.06 41.53 90 top
K3  HF49FD/012-1H12  [RELAY-TH_HF49FD-XXX-1H12-XXX]  67.06 18.54 90 top
K4  HF49FD/012-1H12  [RELAY-TH_HF49FD-XXX-1H12-XXX]  73.28 41.66 90 top
OLED1  -  [0.96OLED_4P]  46 58 0 top
R1  0R  [R0805]  41.92 22.72 90 top
R2  0R  [R0805]  18.87 6.4 180 top
R3  49R9  [R0805]  23.11 8.97 90 top
R4  12K  [R0805]  34.67 22.72 90 top
R5  49R9  [R0805]  23.11 12.96 270 top
R6  300R  [R0805]  7.08 26.6 90 top
R7  300R  [R0805]  3.8 26.61 90 top
R8  49R9  [R0805]  23.24 17.14 270 top
R9  49R9  [R0805]  23.24 21.85 90 top
R10  10K  [R0805]  47.86 30.11 90 top
R11  12K  [R0805]  53.38 43.58 180 top
R12  100R  [R0805]  41.42 30.11 90 top
R13  100R  [R0805]  37.96 35.86 0 top
R14  10K  [R0805]  45.72 30.1 270 top
R15  10K  [R0805]  43.56 30.1 90 top
R16  12K  [R0805]  28.7 31.88 90 top
R17  12K  [R0805]  21.61 36.47 180 top
R18  12K  [R0805]  26.29 26.42 0 top
R19  NC  [R0805]  17.13 35.58 90 top
R20  NC  [R0805]  17.26 27.32 90 top
R21  NC  [R0805]  17.14 31.37 90 top
R22  10K  [R0805]  56.13 12.83 0 top
R23  10K  [R0805]  67.94 2.41 180 top
TP1  -  [M3螺丝]  8 3 0 top
TP2  -  [M2螺丝]  2 2 0 top
TP3  -  [M2螺丝]  88 2 0 top
TP4  -  [M2螺丝]  88 58 0 top
TP5  -  [M2螺丝]  2 58 0 top
U1  CH395Q  [LQFP-64_L10.0-W10.0-P0.50-LS12.0-BL]  42.54 12.83 270 top
U5  AMS1117-3.3  [SOT-223-3_L6.5-W3.4-P2.30-LS7.0-BR]  18.42 49.91 90 top
U6  AMS1117-1.8  [SOT-223-4_L6.5-W3.5-P2.30-LS7.0-BR]  26.16 50.04 90 top
U7  GD32F303CBT6  [LQFP-48_L7.0-W7.0-P0.50-LS9.0-BL]  45.47 38.35 90 top
U8  8M-5032-2P  [CRYSTAL-SMD_L5.0-W3.2]  56.81 37.8 270 top
U9  ULN2003  [SOIC-16_L9.9-W3.9-P1.27-LS6.0-BL]  60.71 24.51 270 top
U10  M24C02-WMN6TP  [SOIC-8_L4.9-W3.9-P1.27-LS6.0-BL]  35.39 53.76 270 top
U11  MAX3485ESA  [SOP-8_L5.0-W4.0-P1.27-LS6.0-BL]  23.11 31.37 90 top
U12  MP-2  [SENSOR-TH_MP-5]  56.64 5.84 90 top
U13  PDS  [SOT_PDS]  67.82 5.97 180 top
X1  30MHz  [OSC-SMD_L5.0-W3.2]  29.46 11.94 90 top

## Footprints (pads in the part's own frame, mm; a bottom-side part is the same pattern mirrored in y, then rotated)
0.96OLED_4P
  round 1.65 hole 1: 1(-3.81,-0.002) 2(-1.27,0.002) 3(1.27,0.002) 4(3.81,0.002)
C0805
  rect 1.41x1.35 smd: 1(-1,0) 2(1,0)
C_Ele_SMD_3x5.4mm
  rect 1.999x0.8 smd: 1(1.374,-0.014) 2(-1.364,-0.014)
CRYSTAL-SMD_L5.0-W3.2
  rect 1.9x2.4 smd: 1(-2.05,0) 2(2.05,0)
DC-2.0
  oval 4x1.3 hole 3.5x0.8: 2(-0.627,5.067)
  oval 1.3x4 hole 0.8x3.5: 3(2.873,0.267) 4(-3.127,0.267)
HDR-TH_4P-P2.54-V-F
  rect 1.7x1.7 hole 1.1: 1(-3.81,0)
  round 1.7 hole 1.1: 2(-1.27,0) 3(1.27,0) 4(3.81,0)
HDR-TH_10P-P2.54-V-M-R2-C5-S2.54
  rect 1.7x1.7 hole 1.1: 1(-5.08,-1.27)
  round 1.7 hole 1.1: 2(-5.08,1.27) 3(-2.54,-1.27) 4(-2.54,1.27) 5(0,-1.27) 6(0,1.27) 7(2.54,-1.27) 8(2.54,1.27) 9(5.08,-1.27) 10(5.08,1.27)
LQFP-48_L7.0-W7.0-P0.50-LS9.0-BL
  oval 0.27x1.5 smd: 1(-2.75,-4.25) 2(-2.25,-4.25) 3(-1.75,-4.25) 4(-1.25,-4.25) 5(-0.75,-4.25) 6(-0.25,-4.25) 7(0.25,-4.25) 8(0.75,-4.25) 9(1.25,-4.25) 10(1.75,-4.25) 11(2.25,-4.25) 12(2.75,-4.25) 25(2.75,4.25) 26(2.25,4.25) 27(1.75,4.25) 28(1.25,4.25) 29(0.75,4.25) 30(0.25,4.25) 31(-0.25,4.25) 32(-0.75,4.25) 33(-1.25,4.25) 34(-1.75,4.25) 35(-2.25,4.25) 36(-2.75,4.25)
  oval 1.5x0.27 smd: 13(4.25,-2.75) 14(4.25,-2.25) 15(4.25,-1.75) 16(4.25,-1.25) 17(4.25,-0.75) 18(4.25,-0.25) 19(4.25,0.25) 20(4.25,0.75) 21(4.25,1.25) 22(4.25,1.75) 23(4.25,2.25) 24(4.25,2.75) 37(-4.25,2.75) 38(-4.25,2.25) 39(-4.25,1.75) 40(-4.25,1.25) 41(-4.25,0.75) 42(-4.25,0.25) 43(-4.25,-0.25) 44(-4.25,-0.75) 45(-4.25,-1.25) 46(-4.25,-1.75) 47(-4.25,-2.25) 48(-4.25,-2.75)
LQFP-64_L10.0-W10.0-P0.50-LS12.0-BL
  oval 0.3x2 smd: 1(-3.75,-5.75) 2(-3.25,-5.75) 3(-2.75,-5.75) 4(-2.25,-5.75) 5(-1.75,-5.75) 6(-1.25,-5.75) 7(-0.75,-5.75) 8(-0.25,-5.75) 9(0.25,-5.75) 10(0.75,-5.75) 11(1.25,-5.75) 12(1.75,-5.75) 13(2.25,-5.75) 14(2.75,-5.75) 15(3.25,-5.75) 16(3.75,-5.75) 33(3.75,5.75) 34(3.25,5.75) 35(2.75,5.75) 36(2.25,5.75) 37(1.75,5.75) 38(1.25,5.75) 39(0.75,5.75) 40(0.25,5.75) 41(-0.25,5.75) 42(-0.75,5.75) 43(-1.25,5.75) 44(-1.75,5.75) 45(-2.25,5.75) 46(-2.75,5.75) 47(-3.25,5.75) 48(-3.75,5.75)
  oval 2x0.3 smd: 17(5.75,-3.75) 18(5.75,-3.25) 19(5.75,-2.75) 20(5.75,-2.25) 21(5.75,-1.75) 22(5.75,-1.25) 23(5.75,-0.75) 24(5.75,-0.25) 25(5.75,0.25) 26(5.75,0.75) 27(5.75,1.25) 28(5.75,1.75) 29(5.75,2.25) 30(5.75,2.75) 31(5.75,3.25) 32(5.75,3.75) 49(-5.75,3.75) 50(-5.75,3.25) 51(-5.75,2.75) 52(-5.75,2.25) 53(-5.75,1.75) 54(-5.75,1.25) 55(-5.75,0.75) 56(-5.75,0.25) 57(-5.75,-0.25) 58(-5.75,-0.75) 59(-5.75,-1.25) 60(-5.75,-1.75) 61(-5.75,-2.25) 62(-5.75,-2.75) 63(-5.75,-3.25) 64(-5.75,-3.75)
M2螺丝
  round 2 hole 1.07: 1(0,0)
M3螺丝
  round 4 hole 3.2: 1(-0.064,0.064)
OSC-SMD_L5.0-W3.2
  rect 1.9x2.4 smd: 1(-2.05,0) 2(2.05,0)
R0805
  rect 1.133x1.377 smd: 1(-1,0) 2(1,0)
RELAY-TH_HF49FD-XXX-1H12-XXX
  round 1.8 hole 1.2: 1(-8.89,0) 2(-6.35,0)
  round 2 hole 1.4: 3(1.27,0) 4(8.89,0)
RJ45-TH_HR911105A
  rect 1.6x1.6 hole 1: 1(-4.45,4.355)
  round 1.6 hole 1: 2(-3.18,6.895) 3(-1.91,4.355) 4(-0.64,6.895) 5(0.63,4.355) 6(1.9,6.895) 7(3.17,4.355) 8(4.44,6.895)
  round 1.8 hole 1.1: 9(-6.625,-6.895) 10(-4.085,-6.895) 11(4.085,-6.895) 12(6.625,-6.895)
  round 2.5 hole 1.8: SH1(-7.745,1.055) SH2(7.745,1.055)
SENSOR-TH_MP-5
  rect 1.8x1.8 hole 1.2: 1(-1.549,-1.55)
  round 1.8 hole 1.2: 2(1.55,-1.55) 3(-1.55,1.55) 4(1.55,1.55)
SOIC-8_L4.9-W3.9-P1.27-LS6.0-BL
  oval 0.588x2.045 smd: 1(-1.905,-2.772) 2(-0.635,-2.772) 3(0.635,-2.772) 4(1.905,-2.772) 5(1.905,2.772) 6(0.635,2.772) 7(-0.635,2.772) 8(-1.905,2.772)
SOIC-16_L9.9-W3.9-P1.27-LS6.0-BL
  oval 0.602x1.971 smd: 1(-4.445,-2.736) 2(-3.175,-2.736) 3(-1.905,-2.736) 4(-0.635,-2.736) 5(0.635,-2.736) 6(1.905,-2.736) 7(3.175,-2.736) 8(4.445,-2.736) 9(4.445,2.736) 10(3.175,2.736) 11(1.905,2.736) 12(0.635,2.736) 13(-0.635,2.736) 14(-1.905,2.736) 15(-3.175,2.736) 16(-4.445,2.736)
SOP-8_L5.0-W4.0-P1.27-LS6.0-BL
  oval 0.574x2.035 smd: 1(-1.905,-2.768) 2(-0.635,-2.768) 3(0.635,-2.768) 4(1.905,-2.768) 5(1.905,2.768) 6(0.635,2.768) 7(-0.635,2.768) 8(-1.905,2.768)
SOT-223-3_L6.5-W3.4-P2.30-LS7.0-BR
  rect 2.5x1.1 smd: 1(2.97,-2.3) 2(2.97,0) 3(2.97,2.3)
  rect 2.34x3.6 smd: 4(-2.97,0)
SOT-223-4_L6.5-W3.5-P2.30-LS7.0-BR
  rect 2.47x0.98 smd: 1(2.835,-2.3) 2(2.835,0) 3(2.835,2.3)
  rect 2.47x3.6 smd: 4(-2.835,0)
SOT_PDS
  rect 0.6x1 smd: 1(-0.889,-1.32) 2(0.061,-1.32) 3(1.011,-1.32) 4(1.011,1.27) 5(-0.889,1.27)
TH_KF128L-5.08-2P
  round 2.4 hole 1.6: 1(-2.54,0) 2(2.54,0)

## Nets
As in the schematic, except:
3V3: C1.1 C2.1 C3.1 C4.1 C5.1 C6.1 C7.1 C8.1 C9.1 C18.1 C20.1 C22.1 C23.1 C26.1 C27.1 C29.1 C30.1 C31.1 C32.1 C37.2 C38.2 H1.2 H2.10 J2.4 J2.5 OLED1.2 R3.2 R5.2 R6.2 R7.2 R8.2 R9.2 R11.2 R14.2 R15.1 R17.2 R18.1 R19.2 R23.1 U1.2 U1.12 U1.17 U1.21 U1.29 U1.40 U1.42 U1.45 U1.64 U5.2 U5.4 U6.3 U7.1 U7.9 U7.24 U7.36 U7.48 U10.8 U11.8 U12.3
GND: C1.2 C2.2 C3.2 C4.2 C5.2 C6.2 C7.2 C8.2 C9.2 C10.2 C11.2 C12.2 C13.2 C14.2 C15.2 C16.1 C17.1 C18.2 C19.2 C20.2 C21.2 C22.2 C23.2 C24.2 C25.2 C26.2 C27.2 C28.2 C29.2 C30.2 C31.2 C32.2 C33.1 C34.1 C35.2 C36.2 C37.1 C38.1 C39.2 C40.1 C41.2 C42.1 DC1.2 DC1.3 H1.3 H2.9 OLED1.1 R1.2 R2.2 R4.2 R10.1 R16.2 R20.1 R22.2 TP2.1 TP3.1 TP4.1 TP5.1 U1.3 U1.9 U1.13 U1.18 U1.20 U1.37 U1.41 U1.44 U1.48 U5.1 U6.1 U7.8 U7.23 U7.35 U7.47 U9.8 U10.1 U10.2 U10.3 U10.4 U10.7 U11.5 U12.2 U13.2
M_SCL: OLED1.3 R15.2 U7.42 U10.6
M_SDA: OLED1.4 R14.1 U7.43 U10.5

Pads without a net: J2 7; U1 14 15 16 22 23 24 25 26 27 30 31 32 33 34 35 38 39 46 47 50 51 53 55 56 57; U7 2 3 4 39 40 41 45 46; U13 5

## Via types
v1: diameter 0.635, hole 0.381, Top Layer to Bottom Layer, 293 vias

## Routing (per net, layer and track width the routed paths; a pad name or vN(x,y) marks a point on that pad's centre or on a via; arc(x,y) is an arc through that point)
1V8: length 104.3
  Top Layer w0.254: 50.14,14.08 50.41,14.08 ; 50.14,14.08 50.14,14.34 ; 50.14,14.08 49.86,14.08 ; 50.41,14.08 50.14,14.34 ; 50.41,14.08 51.15,14.08 C10.1 ; C12.1 39.79,4.58 U1.19 39.79,9.08 40.05,9.34 ; 47.28,17.88 47.3,17.88 47.62,18.19 ; 47.28,17.88 47.28,17.27 46.58,16.57 44.06,16.57 ; 47.28,17.88 47.28,18.19 ; 41.84,15.17 41.84,14.08 41.61,13.84 v1(40.05,13.84) 40.05,9.62 ; 41.84,15.17 41.84,15.41 ; 41.84,15.17 41.57,15.45 41.57,15.49 ; 41.84,15.17 42.09,15.42 42.09,15.49 ; 50.14,14.34 50.14,14.36 ; 50.14,14.36 50.14,17.99 49.94,18.19 47.62,18.19 ; 50.14,14.36 49.86,14.08 ; 42.09,15.49 43.63,15.49 43.79,15.65 43.79,16.35 ; 42.09,15.49 41.57,15.49 ; U1.63 39.31,18.56 39.31,15.66 39.49,15.49 41.57,15.49 ; 40.36,9.32 44.11,9.32 44.29,9.13 U1.28 ; 40.36,9.32 40.05,9.62 ; 40.36,9.32 40.07,9.32 40.05,9.34 ; 44.06,16.57 43.79,16.84 ; 44.06,16.57 43.84,16.35 43.79,16.35 ; 43.79,16.84 43.79,16.35 ; 43.79,16.84 43.79,18.57 U1.54 ; 47.28,18.19 47.28,20.98 C14.1 ; 47.28,18.19 47.62,18.19 ; 49.86,14.08 U1.43 ; 40.05,9.34 40.05,9.62 ; 47.62,18.19 47.29,18.53 ; v1(38.35,13.84) 38.12,14.08 U1.6
  Top Layer w0.508: C11.1 C14.1 ; C12.1 C15.1 C13.1
  Bottom Layer w0.508: 39.98,13.84 v1(38.35,13.84) 36.87,13.84 36.5,14.21 36.5,41.36 36.17,41.69 v1(25.1,41.69) v1(24.23,41.69)
3V3: length 462.3
  Top Layer w0.254: 50.12,4.33 50.12,4.49 50.46,4.83 ; 47.82,37.26 47.82,36.65 48.87,35.6 U7.1 ; 47.82,37.26 47.82,37.69 ; 47.82,37.26 47.5,37.58 ; 51.4,43.68 51.4,43.59 51.1,43.29 ; 50.46,4.83 50.46,4.35 50.44,4.33 ; 50.46,4.83 50.46,12.25 ; 50.46,4.83 50.79,4.5 50.79,4.33 ; 43.22,37.85 43.22,38.18 42.72,38.69 U7.24 42.38,42.94 C31.1 ; 43.22,37.85 43.49,37.58 ; 43.22,37.85 43.22,37.58 ; 43.45,37.58 43.22,37.36 ; 43.45,37.58 43.49,37.58 ; 43.45,37.58 43.22,37.58 ; 43.22,37.36 43.22,37.58 ; 43.22,37.36 43.22,36.58 42.21,35.57 41.25,35.57 U7.36 41.22,34.78 40.16,33.72 ; 43.49,37.58 47.5,37.58 ; 47.5,37.58 47.82,37.91 ; 47.5,37.58 47.72,37.58 47.82,37.69 ; 46.8,13.82 46.8,13.57 ; 46.8,13.82 47.05,13.57 ; 46.8,13.82 46.8,14.86 47.01,15.08 U1.45 ; 46.8,13.57 47.05,13.57 ; 46.8,13.57 46.8,13.32 ; 51.1,43.31 51.1,43.67 51.1,43.68 ; 51.1,43.31 50.73,43.68 ; 51.1,43.31 51.1,43.29 ; 47.05,13.57 48.29,13.57 U1.42 ; 47.05,13.57 46.8,13.32 ; 50.74,12.58 50.74,12.52 50.46,12.25 ; 50.74,12.58 51.8,12.58 C4.1 ; 50.74,12.58 50.46,12.58 ; 39.5,21.22 38.79,20.51 U1.64 38.44,18.58 38.27,18.41 38.27,16.27 38.08,16.09 36.8,16.09 U1.2 35.62,16.08 35.42,16.28 35.42,17.08 35.06,17.44 v1(33.89,17.44) ; 50.46,12.58 50.13,12.58 ; 50.46,12.58 50.46,12.25 ; 50.13,12.58 50.46,12.25 ; 50.13,12.58 U1.40 47.03,12.58 46.8,12.81 46.8,13.32 ; U7.48 49.47,34.1 C30.1 ; 47.82,37.69 47.82,37.91 ; 47.82,37.91 47.82,38.63 48.79,39.6 U7.9 50.81,39.6 51.1,39.89 51.1,43.29 ; 52.14,43.58 R11.2 ; v1(38.31,11.09) 38.3,11.08 U1.12 ; U1.29 44.79,4.47 44.65,4.33 ; v1(38.24,6.37) 38.79,6.92 U1.17 ; U1.21 40.79,5.86 41.91,4.74 C6.1
  Top Layer w0.508: 45.84,27.99 45.84,28.34 ; 45.84,27.99 45.49,27.99 ; 45.84,27.99 46.19,27.99 ; 45.84,28.34 45.84,28.98 R14.2 R15.1 ; 45.84,28.34 45.49,27.99 ; 45.84,28.34 46.19,27.99 ; J2.5 16.43,15.37 15.92,14.86 15.92,6.72 15.59,6.38 14.17,6.38 13.71,5.92 C26.1 13.71,2.55 C27.1 13.7,1.02 13.95,0.78 26.44,0.78 26.8,1.13 H1.2 26.8,5.32 27.17,5.69 37.57,5.69 v1(38.24,6.37) ; 45.49,27.99 43.56,27.99 42.57,26.99 40.57,26.99 40.16,27.4 40.16,33.72 ; v1(68.96,0.86) 68.96,2.4 R23.1 ; 52.14,43.58 52.05,43.68 C29.1 ; 30.56,59.32 30.56,58.75 ; 30.56,59.32 31.03,59.32 ; 30.56,59.32 30,59.32 ; 30.56,58.75 31.03,59.22 31.03,59.32 ; 30.56,58.75 30.56,43.35 30.97,42.94 C31.1 ; 30.56,58.75 30,59.32 ; R3.2 23.11,9.97 R5.2 24.59,11.96 24.88,12.26 24.88,15.81 24.55,16.14 R8.2 22.75,16.64 J2.4 ; 31.03,59.32 36.06,59.32 36.42,58.95 C37.2 38.16,56.07 U10.8 44.39,55.67 44.74,56.03 44.74,57.99 OLED1.2 ; 22.86,29.09 22.83,29.11 22.83,34.27 22.45,34.65 21.33,34.65 20.61,35.37 R17.2 ; C6.1 C3.1 C5.1 C9.1 55.06,4.33 U12.3 ; 30,59.32 28.09,59.32 27.8,59.03 27.8,56.29 27.49,55.98 25.04,55.98 C22.1 25.02,55.75 23.86,54.6 U6.3 23.86,51.51 22.51,50.17 18.64,50.17 18.55,50.07 ; C1.1 C2.1 52.98,21.51 53.35,21.15 53.35,12.84 52.99,12.49 52,12.49 C4.1 ; 16.66,41.83 2.92,41.83 2.28,41.19 2.28,28.07 2.74,27.61 R7.2 7.07,27.61 R6.2 ; C30.1 51.69,33.4 52.44,32.66 52.44,28.39 52.03,27.99 46.19,27.99 ; C7.1 C8.1
  Bottom Layer w0.254: v1(38.31,11.09) 38.93,11.09 39.18,10.83 39.18,6.65 38.9,6.37 v1(38.24,6.37)
  Bottom Layer w0.508: J2.5 18.62,15.37 J2.4 24.67,16.64 25.11,17.08 25.11,24 v1(25.04,24.08) ; v1(24.23,24.1) 25.01,24.1 v1(25.04,24.08) ; 54.57,0.78 55.09,1.3 ; 54.57,0.78 55.51,0.78 ; 54.57,0.78 28.22,0.78 26.84,2.16 H1.2 ; 55.09,1.3 U12.3 ; 55.09,1.3 55.51,0.88 55.51,0.78 ; H2.10 73.25,57.88 77.25,57.88 77.87,57.26 77.87,1.24 77.4,0.78 55.51,0.78 ; v1(25.04,24.08) 33.4,24.08 33.83,23.65 33.83,17.5 v1(33.89,17.44) ; 68.96,0.85 v1(68.96,0.86)
GND: length 95.9
  Top Layer w0.254: v1(34.72,16.66) 34.72,16.31 35.46,15.58 U1.3 ; v1(48.41,17.32) 48.41,16.69 U1.48 49.45,16.58 49.66,16.37 49.66,14.75 49.48,14.58 U1.44 ; C32.2 38.12,34.08 38.53,34.5 39.56,34.5 39.93,34.86 39.93,35.85 40.19,36.1 U7.35 ; U1.13 37.9,10.58 v1(38.32,10.16) ; v1(48.47,38.3) 48.47,38.63 48.94,39.1 U7.8 ; U1.41 49.86,13.08 v1(50.12,13.34) ; U1.18 39.29,6.3 39.28,6.28 39.28,5.58 39.08,5.38 38.5,5.38 v1(38.43,5.46) ; U1.37 46.54,11.08 v1(45.21,12.41) ; v1(38.26,12.61) 38.22,12.58 U1.9 ; v1(40.46,8.58) 40.46,8.48 40.29,8.32 U1.20 ; C31.2 42.85,44.94 43.22,44.58 U7.23 ; U7.47 47.72,33.31 49.62,31.4 C30.2
  Top Layer w0.508: v1(52.27,38.97) v1(52.27,40.12) 53.13,40.98 C34.1 54.02,40.98 v1(54.73,41.69) v1(55.65,41.69) v1(56.51,41.69) v1(57.32,41.69) v1(58.1,41.69) 58.12,41.71 v1(58.95,41.71) 59.44,41.22 59.44,40.71 v1(59.45,40.7) 59.45,39.89 v1(59.44,39.87) 59.44,38.99 v1(59.45,38.98) 59.45,38.11 v1(59.43,38.08) 59.43,37.26 v1(59.45,37.24) 59.45,36.41 v1(59.45,36.4) 59.45,35.65 v1(59.45,35.64) 59.45,34.84 v1(59.43,34.83) 59.43,34.42 v1(59.07,34.06) 58.9,33.89 v1(58.18,33.89) v1(57.31,33.89) v1(56.46,33.89) v1(55.61,33.89) v1(54.75,33.89) 53.96,34.68 C33.1 53.1,34.68 v1(52.25,35.53) 52.23,35.55 v1(52.23,36.84) ; U13.2 67.76,8.16 v1(67.77,8.17) ; R10.1 49.81,29.11 50.17,29.47 C30.2 51.42,31.4 v1(51.43,31.39) ; v1(34.89,10.83) 34.35,10.29 v1(34.35,10.18) v1(34.35,9.41) 34.35,9.09 v1(34,8.74) 32.8,8.74 C17.1 32.77,8.76 31.88,7.87 v1(30.57,7.87) v1(29.61,7.87) v1(28.76,7.87) v1(27.85,7.87) 27.31,7.87 v1(27.08,8.1) 26.8,8.38 v1(26.8,8.92) v1(26.8,9.84) v1(26.8,10.67) v1(26.8,11.53) v1(26.8,12.34) v1(26.8,13.18) v1(26.8,14.09) v1(26.8,14.91) 26.8,15.37 v1(27.14,15.71) 27.43,16 v1(27.99,16) v1(28.81,16) v1(29.64,16) v1(30.54,16) v1(31.37,16) 31.86,16 C16.1 33.8,15.1 34.29,14.61 v1(34.29,14.23) v1(34.29,13.36) v1(34.93,12.72)
  vias: v1(1.43,17.56) v1(1.42,16.71) v1(2.36,17.55) v1(2.36,16.71) v1(2.89,6.35) v1(2.89,5.5) v1(3.43,50.17) v1(3.43,49.32) v1(3.83,6.34) v1(3.82,5.5) v1(4.07,44.37) v1(4.06,43.53) v1(4.37,50.16) v1(4.36,49.32) v1(5.01,44.37) v1(5,43.53) v1(5.08,56.1) v1(5.08,55.25) v1(6.02,56.1) v1(6.01,55.25) v1(9.33,16.43) v1(9.32,15.58) v1(10.26,16.42) v1(10.25,15.58) v1(10.83,5.66) v1(10.82,4.81) v1(11.08,29.18) v1(11.07,28.34) v1(11.2,38.86) v1(11.2,38.02) v1(11.76,5.65) v1(11.76,4.81) v1(12.01,29.18) v1(12.01,28.34) v1(12.14,38.86) v1(12.13,38.02) v1(17.56,10.1) v1(17.55,9.25) v1(18.48,24.32) v1(18.48,23.47) v1(18.49,10.09) v1(18.49,9.25) v1(18.51,3.98) v1(18.5,3.13) v1(19.42,24.32) v1(19.41,23.47) v1(19.44,3.97) v1(19.44,3.13) v1(21.33,40.75) v1(21.32,39.91) v1(21.6,46.42) v1(21.59,45.57) v1(22.27,40.75) v1(22.26,39.91) v1(22.53,46.41) v1(22.53,45.57) v1(27.64,35.9) v1(27.65,36.75) v1(28.14,17.94) v1(28.13,17.1) v1(28.59,36.74) v1(28.58,35.9) v1(29.07,17.94) v1(29.07,17.1) v1(29.35,39.9) v1(30.34,27.67) v1(30.33,26.82) v1(31.28,27.66) v1(31.27,26.82) v1(31.56,7.87) v1(31.89,21.21) v1(31.88,20.37) v1(32.38,33.8) v1(32.38,32.95) v1(32.82,21.21) v1(32.82,20.37) v1(33.19,48.6) v1(33.19,47.75) v1(33.19,46.75) v1(33.19,45.9) v1(33.32,33.79) v1(33.31,32.95) v1(33.97,14.93) v1(34.13,48.59) v1(34.12,47.75) v1(34.13,46.74) v1(34.12,45.9) v1(38.73,58.54) v1(38.72,57.7) v1(39.66,58.54) v1(39.66,57.7) v1(40.37,49.9) v1(40.37,49.05) v1(41.31,49.89) v1(41.3,49.05) v1(41.72,33.65) v1(43.66,39.84) v1(43.92,36.81) v1(44.28,13.26) v1(44.27,12.41) v1(44.61,26.06) v1(45.22,13.25) v1(47.72,7.35) v1(47.71,6.5) v1(48.65,6.5) v1(48.65,7.35) v1(51.64,2.81) v1(51.64,1.96) v1(51.91,56.89) v1(51.9,56.05) v1(52.58,2.8) v1(52.57,1.96) v1(52.84,56.89) v1(52.84,56.05) v1(54.7,29.98) v1(54.69,29.14) v1(55.54,17.86) v1(55.63,29.98) v1(55.63,29.14) v1(55.55,18.71) v1(56.48,18.7) v1(56.48,17.86) v1(57.67,54.97) v1(58.31,11.01) v1(58.3,10.16) v1(59.24,11) v1(59.24,10.16) v1(59.92,2.98) v1(59.91,2.13) v1(60.54,52.29) v1(60.53,51.44) v1(60.85,2.13) v1(60.86,2.97) v1(61.26,40.8) v1(61.26,39.95) v1(61.48,52.28) v1(61.47,51.44) v1(62.2,40.79) v1(62.19,39.95) v1(62.38,46.81) v1(62.37,45.97) v1(63.31,46.81) v1(63.31,45.97) v1(65.66,3.9) v1(67.32,23.81) v1(67.88,46.9) v1(67.87,46.05) v1(68.56,17.59) v1(68.55,16.74) v1(68.82,46.89) v1(68.81,46.05) v1(69.5,17.58) v1(69.49,16.74) v1(69.64,13.1) v1(73.17,24.06) v1(73.16,23.21) v1(74.1,24.05) v1(74.1,23.21) v1(74.38,17.21) v1(74.37,16.36) v1(74.85,52.77) v1(74.85,53.62) v1(75.32,17.2) v1(75.31,16.36) v1(75.79,53.61) v1(75.78,52.77) v1(81.9,3.74) v1(81.89,2.9) v1(82.83,3.74) v1(82.83,2.9) v1(85.9,36.3) v1(85.9,35.45) v1(86,48.05) v1(85.99,47.2) v1(86.01,23.55) v1(86,22.7) v1(86.07,11.86) v1(86.06,11.02) v1(86.84,36.29) v1(86.83,35.45) v1(86.93,48.04) v1(86.93,47.2) v1(86.94,23.54) v1(86.94,22.7) v1(87,11.86) v1(87,11.02)
PGND: length 26.3
  Top Layer w1.016: TP1.1 7.68,3.32 7.68,6.78 8.55,7.65 13.45,7.65 J2.SH2 J2.SH1
BOOT0: length 4.3
  Top Layer w0.254: R10.2 47.88,31.13 47.88,32.49 47.59,32.78 46.53,32.78 46.22,33.1 U7.44
DC: length 120.8
  Top Layer w0.508: K3.1 66.81,9.4 U13.3
  Bottom Layer w1.016: 64.55,32.66 64.55,31.62 ; 64.55,32.66 64.57,32.64 65.57,32.64 ; 64.55,32.66 64.55,33.8 ; 64.55,31.62 65.57,32.64 ; 64.55,31.62 64.55,10.61 65.51,9.65 K3.1 73.15,9.65 K1.1 ; 65.57,32.64 65.57,32.78 64.55,33.8 ; 65.57,32.64 K2.1 73.15,32.64 K4.1 ; DC1.4 13.13,53.22 14.14,54.23 55.57,54.23 56.59,53.22 56.59,44.96 57.38,44.17 63.68,44.17 64.55,43.3 64.55,33.8
ETH_CS: length 27.2
  Top Layer w0.254: v1(41.39,16.98) 41.29,17.07 U1.59 ; v1(40.72,41.57) 41.19,41.1 U7.25
  Bottom Layer w0.254: v1(41.39,16.98) 41.44,17.04 41.44,20.66 40.72,21.38 v1(40.72,41.57)
ETH_INT#: length 26.7
  Top Layer w0.254: v1(46.31,17.22) 46.29,17.23 U1.49 ; v1(42.51,37.57) 42.49,37.6 U7.32
  Bottom Layer w0.254: v1(42.51,37.57) 42.49,37.55 42.49,17.44 42.72,17.22 v1(46.31,17.22)
ETH_RSTI: length 41.7
  Top Layer w0.254: U7.29 41.18,39.07 38.27,39.07 v1(38.09,39.25) ; v1(40.77,10.61) 40.8,10.58 U1.36
  Bottom Layer w0.254: v1(38.09,39.25) 38.09,18.76 38.37,18.48 40.42,18.48 40.74,18.16 40.74,10.63 v1(40.77,10.61)
ETH_SCK: length 24.3
  Top Layer w0.254: U1.60 40.79,20.08 v1(40.65,20.22) ; U7.26 40.41,40.6 v1(39.94,41.07)
  Bottom Layer w0.254: v1(39.94,41.07) 40.19,40.82 40.19,20.68 v1(40.65,20.22)
ETH_SDI: length 23.5
  Top Layer w0.254: v1(39.46,39.72) 39.58,39.6 U7.28 ; U1.61 40.28,18.6 40.28,19.68 39.78,20.17 v1(39.47,20.17)
  Bottom Layer w0.254: v1(39.46,39.72) 39.47,39.71 v1(39.47,20.17)
ETH_SDO: length 31.9
  Top Layer w0.254: U1.62 39.81,18.56 39.81,17.06 v1(40.09,16.78) ; 41.15,40.1 39.99,40.1 39.67,40.43 37.41,40.43 v1(37.39,40.41)
  Bottom Layer w0.254: v1(37.39,40.41) 37.42,40.38 37.42,17.1 37.74,16.78 v1(40.09,16.78)
K11: length 20.6
  Top Layer w0.254: K1.3 77.33,19.69 77.7,19.31 77.7,9.29 78.16,8.83 83.38,8.83 CN1.1
K12: length 23.2
  Top Layer w0.254: CN1.2 83.32,13.85 78.64,13.85 78.27,14.22 78.27,26.91 77.87,27.31 K1.4
K21: length 25.3
  Top Layer w0.254: 83.31,33.15 83.11,32.94 81.27,32.94 80.91,33.3 80.91,37.14 80.49,37.57 67.83,37.57 67.4,38 67.4,42.46 67.06,42.8
K22: length 27.9
  Top Layer w0.254: CN2.2 72.03,38.23 71.65,38.62 71.65,49.95 71.23,50.37 67.11,50.37 K2.4
K31: length 32.1
  Top Layer w0.254: K3.3 68.44,19.81 68.87,20.24 68.87,28.31 69.32,28.76 79.8,28.76 80.46,28.1 80.46,21.34 80.84,20.96 83.18,20.96 CN3.1
K32: length 21.3
  Top Layer w0.254: CN3.2 83.44,28.75 82.81,29.38 67.51,29.38 67.18,29.05 67.18,27.55 K3.4
K41: length 11.7
  Top Layer w0.254: CN4.1 73.83,44.96 73.28,44.4 K4.3
K42: length 10.2
  Top Layer w0.254: CN4.2 82.8,50.55 K4.4
LINK#: length 65.3
  Top Layer w0.254: U1.52 44.79,19.95 44.68,20.06 43.42,20.06 43.11,20.37 43.11,24.9 42.72,25.3 31.24,25.3 31.04,25.09 31.04,22.13 30.79,21.88 16.11,21.88 15.86,22.13 15.86,25.56 15.63,25.8 9.04,25.8 8.7,25.46 8.7,20.26 8.5,20.06 6.89,20.06 6.87,20.08 J2.10 J2.11
M_C: length 2.4
  Top Layer w0.254: U7.34 39.83,36.6 39.09,35.86
M_D: length 4
  Top Layer w0.254: R12.2 41.4,31.13 41.4,32.48 41.63,32.71 42.46,32.71 42.72,32.96 U7.37
M_DIR: length 22.8
  Top Layer w0.254: U11.3 U11.2 28.56,30.73 R16.1 28.8,30.78 30.3,30.78 30.49,30.97 30.49,36.9 30.7,37.1 U7.33
M_IO_PA4: length 28.2
  Top Layer w0.254: v1(58.78,47.43) 58.36,47.84 47.94,47.84 47.72,47.62 U7.14
  Bottom Layer w0.254: H2.1 59.15,55.25 58.78,54.88 v1(58.78,47.43)
M_IO_PA5: length 30.3
  Top Layer w0.254: U7.15 47.22,48.1 47.42,48.3 64.59,48.3 65.25,48.96 65.25,54.96 H2.3
M_IO_PA6: length 35.8
  Top Layer w0.254: U7.16 46.72,48.58 46.89,48.76 63.92,48.76 64.35,49.19 64.35,56.19 64.62,56.46 67.85,56.46 68.07,56.24 H2.5
M_IO_PA7: length 36.7
  Top Layer w0.254: U7.17 46.22,49.01 46.42,49.21 62.71,49.21 62.98,49.48 v1(62.98,52.67)
  Bottom Layer w0.254: H2.7 70.71,55.15 70.71,53.05 70.41,52.76 63.07,52.76 v1(62.98,52.67)
M_IO_PB1: length 32.8
  Top Layer w0.254: H2.2 62.96,57.82 v1(56.38,57.82) ; U7.19 45.22,49.49 45.4,49.67 56.15,49.67 56.33,49.85 v1(56.33,55.64)
  Bottom Layer w0.254: v1(56.38,57.82) 56.33,57.77 v1(56.33,55.64)
M_IO_PB2: length 34.8
  Top Layer w0.254: H2.4 65.08,57.78 63.9,56.61 55.76,56.61 55.42,56.26 55.42,50.4 55.15,50.13 44.92,50.13 44.72,49.93 U7.20
M_IO_PB10: length 40.8
  Top Layer w0.254: U7.21 44.22,50.43 44.44,50.64 54.38,50.64 54.67,50.94 54.67,58.72 54.96,59.01 67.78,59.01 68.07,58.71 H2.6
M_IO_PB11: length 44.8
  Top Layer w0.254: H2.8 70.61,59.14 70.28,59.46 54.23,59.46 53.88,59.11 53.88,51.42 53.65,51.2 43.97,51.2 43.72,50.94 U7.22
M_K1: length 28.1
  Top Layer w0.254: v1(46.99,39.94) 48.49,39.94 48.65,40.1 U7.10 ; v1(47.17,27.11) 47.23,27.16 56.61,27.16 57.14,27.69 U9.2 U9.1
  Bottom Layer w0.254: v1(46.99,39.94) 46.99,27.12 47,27.11 v1(47.17,27.11)
M_K2: length 27.8
  Top Layer w0.254: U7.11 49.71,40.6 v1(47.66,40.6) ; U9.4 U9.3 47.88,26.42 v1(47.84,26.38)
  Bottom Layer w0.254: v1(47.84,26.38) 47.82,26.4 47.82,40.44 v1(47.66,40.6)
M_K3: length 29.6
  Top Layer w0.254: U7.12 49.72,41.51 v1(49.67,41.56) ; U9.6 U9.5 56.54,23.88 56.33,24.09 56.33,25.49 56.15,25.67 48.52,25.67 v1(48.51,25.66)
  Bottom Layer w0.254: v1(48.51,25.66) 49.34,25.66 49.68,26 49.68,41.55 v1(49.67,41.56)
M_K4: length 37.1
  Top Layer w0.254: v1(46.34,25.05) 46.38,25.01 55.45,25.01 55.78,24.67 55.78,21.56 56.02,21.32 57.96,21.32 U9.7 ; U7.13 48.22,43.63 v1(48.44,43.85)
  Bottom Layer w0.254: v1(48.44,43.85) 46.56,43.85 46.31,43.61 46.31,25.07 v1(46.34,25.05)
M_KC1: length 26.3
  Top Layer w0.254: U9.16 U9.15 65.2,27.69 65.61,27.28 65.61,15.09 65.87,14.83 73.06,14.83 73.35,14.54 73.35,12.13 73.28,12.06
M_KC2: length 17.7
  Top Layer w0.254: K2.2 66.27,35.97 62.21,35.97 61.76,35.52 61.76,26.72 62.06,26.42 U9.14 U9.13
M_KC3: length 14.9
  Top Layer w0.254: U9.12 U9.11 64.52,22.61 64.94,22.18 64.94,12.42 65.17,12.19 K3.2
M_KC4: length 30.4
  Top Layer w0.254: U9.10 61.44,21.34 61.21,21.57 61.21,36.11 61.82,36.71 72.95,36.71 73.28,36.39 K4.2
M_RST#: length 11.8
  Top Layer w0.254: 54.45,43.32 54.38,43.39 C28.1 ; 54.45,43.32 54.45,42.43 54.09,42.08 51.87,42.08 51.58,41.78 51.58,38.89 51.29,38.6 U7.7 ; 54.45,43.32 54.45,43.6
M_RXD: length 27.3
  Top Layer w0.254: 27.29,29.23 27.53,29.46 ; 27.29,29.23 27.05,29.46 ; 27.29,29.23 R18.2 ; 27.53,29.46 34.87,29.46 v1(34.98,29.58) ; 27.53,29.46 27.05,29.46 ; U7.31 35.12,38.1 v1(34.98,37.96) ; 27.05,29.46 U11.1
  Bottom Layer w0.254: v1(34.98,29.58) 34.98,37.95 v1(34.98,37.96)
M_SCL: length 47.1
  Top Layer w0.254: R15.2 43.56,32.6 43.77,32.81 44.96,32.81 45.22,33.07 U7.42 45.22,34.94 v1(44.75,35.41) ; U10.6 36.47,53.13 v1(36.43,53.09) ; OLED1.3 47.35,57.92 47.35,53.38 47.1,53.12 38.23,53.12
  Bottom Layer w0.254: v1(44.75,35.41) 44.75,46.45 44.39,46.81 36.78,46.81 36.43,47.16 v1(36.43,53.09)
M_SDA: length 45.6
  Top Layer w0.254: R14.1 45.72,34.1 U7.43 45.72,35.36 v1(45.67,35.41) ; OLED1.4 49.81,52.08 49.56,51.83 38.31,51.83 ; U10.5 38.02,51.72 v1(38.02,50.95)
  Bottom Layer w0.254: v1(38.02,50.95) 38.02,47.77 38.29,47.5 45.28,47.5 45.63,47.15 45.63,35.44 v1(45.67,35.41)
M_TXD: length 24.6
  Top Layer w0.254: 25.59,36.47 25.88,36.18 U11.4 ; 25.59,36.47 25.85,36.47 25.88,36.43 25.88,36.75 ; 25.59,36.47 25.57,36.47 ; 25.57,36.47 25.86,36.75 25.88,36.75 ; 25.57,36.47 R17.1 ; 25.88,36.75 25.88,38.27 26.21,38.6 U7.30 ; 25.88,36.43 25.88,36.18
M_X1: length 7.9
  Top Layer w0.254: U7.5 52.67,37.6 C33.2 55.66,36.68 56.66,35.67 56.83,35.67
M_X2: length 7.8
  Top Layer w0.254: 56.83,39.77 56.04,38.98 C34.2 52.73,38.1 52.15,38.1 52.15,38.1 U7.6
RXN: length 47.5
  Top Layer w0.254: U1.5 36.8,14.57 38.75,14.57 39,14.32 39,9.65 36.26,6.9 36.01,6.9 35.83,7.08 35.83,7.84 35.65,8.02 35.5,8.02 35.32,7.84 35.32,6.9 35.14,6.72 34.99,6.72 34.81,6.9 34.81,7.84 34.63,8.02 34.49,8.02 34.31,7.84 34.31,6.9 34.13,6.72 26.19,6.72 26.01,6.9 26.01,9.31 25.83,9.49 25.69,9.49 25.51,9.31 25.51,6.9 25.33,6.72 25.18,6.72 25,6.9 25,9.31 24.82,9.49 24.67,9.49 24.49,9.31 24.49,6.9 24.31,6.72 23.85,6.72 23.24,7.33 23.24,7.84 R3.1 22.38,7.97 21.59,8.76 21.59,13 20.49,14.1 J2.6
RXP: length 47.4
  Top Layer w0.254: 18.68,15.36 18.68,15.09 ; 18.68,15.36 18.71,15.39 18.98,15.39 ; 18.68,15.36 18.68,15.68 ; 18.68,15.09 18.98,15.39 ; 18.68,15.09 18.68,13.06 18.99,12.76 20.78,12.76 21.06,12.49 21.06,7.97 22.7,6.32 36.24,6.32 39.41,9.48 39.41,14.75 39.08,15.08 U1.4 ; 18.98,15.39 20.69,15.39 22.12,13.96 R5.1 ; 18.98,15.39 18.68,15.68 ; J2.3 18.45,17.91 18.68,17.68 18.68,15.68
S_CTRL: length 58.7
  Top Layer w0.254: 66.81,4.7 66.94,4.56 R23.2 66.83,2.3 v1(65.4,2.3) ; U7.38 43.22,35.82 43.45,36.05 47.73,36.05 48.88,34.9 51.22,34.9 54.11,32.02 v1(59.23,32.02)
  Bottom Layer w0.254: v1(65.4,2.3) 62.4,2.3 61.96,2.74 61.96,31.49 61.43,32.02 v1(59.23,32.02)
SEN_OUT: length 45.7
  Top Layer w0.254: v1(50.37,42.22) 49.1,42.22 48.34,41.45 45.97,41.45 45.72,41.71 U7.18 ; v1(54.11,24.18) 54.11,16.12 54.36,15.88 C39.1 55.39,13.08 R22.1 55.13,7.43 U12.4
  Bottom Layer w0.254: v1(54.11,24.18) 50.58,24.18 50.37,24.4 v1(50.37,42.22)
TXN: length 23.8
  Top Layer w0.254: J2.2 19.89,18.33 20.08,18.14 R8.1 23.24,19.1 23.42,19.28 25.27,19.28 25.45,19.1 25.45,18.84 25.63,18.66 25.78,18.66 25.96,18.84 25.96,19.1 26.14,19.28 26.29,19.28 26.47,19.1 26.47,18.84 26.65,18.66 26.8,18.66 26.98,18.84 26.98,19.1 27.16,19.28 30.53,19.28 35.04,14.77 35.04,13.6 35.56,13.08 U1.8
TXP: length 23.7
  Top Layer w0.254: J2.1 17.73,20.83 23.13,20.83 23.13,19.98 23.42,19.69 30.7,19.69 35.45,14.94 35.45,13.83 35.7,13.58 U1.7
V_HU: length 15.8
  Top Layer w0.254: 63.88,6.3 63.88,5.97 ; 63.88,6.3 63.88,7.64 C42.2 ; 63.88,6.3 64.21,5.97 64.21,5.95 ; 63.88,5.97 63.9,5.95 64.21,5.95 ; 63.88,5.97 63.88,5.71 ; 64.21,5.95 63.97,5.71 63.88,5.71 ; 64.21,5.95 68.28,5.95 68.71,6.38 U13.1 ; 63.88,5.71 C40.2 63.75,4.29 U12.1
XI: length 8.1
  Top Layer w0.254: U1.10 34.53,12.08 33.77,12.84 33.02,12.84 C16.2 31.61,13.1 30.72,13.99 X1.2
XO: length 8
  Top Layer w0.254: X1.1 30.84,9.89 31.73,10.78 C17.2 33.77,10.78 34.56,11.58 U1.11
$1N6890: length 6.7
  Top Layer w0.254: U1.1 36.79,18.88 36.6,19.07 34.99,19.07 34.67,19.39 34.67,21.42
$1N7627: length 2.9
  Top Layer w0.254: U1.58 41.79,21.3 41.92,21.42
$1N10654: length 5.2
  Top Layer w0.254: 20.04,6.43 19.89,6.57 J2.8
$1N10919: length 18.3
  Top Layer w0.254: J2.12 6.09,9.39 4.13,9.39 3.8,9.72 R7.1
$1N10952: length 3.4
  Top Layer w0.254: R6.1 7.08,23.6 J2.9
$2N5291: length 39.7
  Top Layer w0.254: v1(41.43,27.82) 41.42,27.83 R12.1
  Bottom Layer w0.254: H1.1 30.44,2.16 30.45,2.17 41.68,2.17 42.03,2.53 42.03,21.25 41.43,21.86 v1(41.43,27.82)
$2N5344: length 48.6
  Top Layer w0.254: 37.09,35.86 36.99,35.77 v1(35.73,35.77)
  Bottom Layer w0.254: v1(35.73,35.77) 35.72,35.76 35.72,4.28 35.42,3.99 22.11,3.99 21.72,3.59 H1.4
$2N14954: length 22.6
  Top Layer w0.254: U11.7 17.51,30.73 R21.1 ; R21.1 16.86,30.65 14.09,30.65 13.83,30.9 13.83,34 13.56,34.27 5.32,34.27 5,33.95 CN5.2 ; R21.1 17.14,28.43 R20.2
$2N14989: length 22.8
  Top Layer w0.254: CN5.1 5,35.38 5.31,35.08 14.05,35.08 14.31,34.82 14.31,32.22 14.53,32 16.78,32 R21.2 17.51,32 U11.6 ; 17.14,32.5 17.13,32.51 R19.1

## Copper pours and planes (outline as drawn; the poured copper is in the pictures)
1V8 on Top Layer: 23.62,54.1 27.94,54.1 27.94,39.12 23.62,39.12
3V3 on Top Layer: 19.3,29.72 25.91,29.72 25.91,25.78 19.3,25.78
3V3 on Top Layer: 16.51,57.66 20.19,57.66 20.19,45.72 16.51,45.72
3V3 on Top Layer: 15.88,46.1 21.21,46.1 21.21,35.81 15.88,35.81
3V3 on Top Layer: 21.49,27.4 25.91,27.4 25.91,22.27 21.49,22.27
GND on Top Layer: -2.05,62.78 90.65,62.78 92.58,60.85 92.58,-2.83 90.81,-4.6 -2.37,-4.6 -2.53,-4.44 -2.53,62.3
GND on Bottom Layer: -2.37,63.42 93.55,63.42 93.87,63.1 93.87,-3.48 93.39,-3.96 -2.53,-3.96 -3.02,-4.44 -3.02,62.78
DC on Top Layer: 8.76,57.61 16.76,57.61 16.76,47.62 8.76,47.62
DC on Top Layer: 61.81,20.41 66.6,20.41 66.6,9.31 61.81,9.31
DC on Top Layer: 66.09,10.58 74.29,10.58 74.29,5.59 66.09,5.59

## Text on the board
Top Silkscreen Layer: GND | 3V3 | A4 | B1 | B2 | A5 | B10 | A6 | B11 | A7
